# EAGLE schematic haasoscope_pro_adc_fpga_board (EAGLE 9.6.2), part 2 of 3
## Sheet 8 of 16: Other FPGA IO
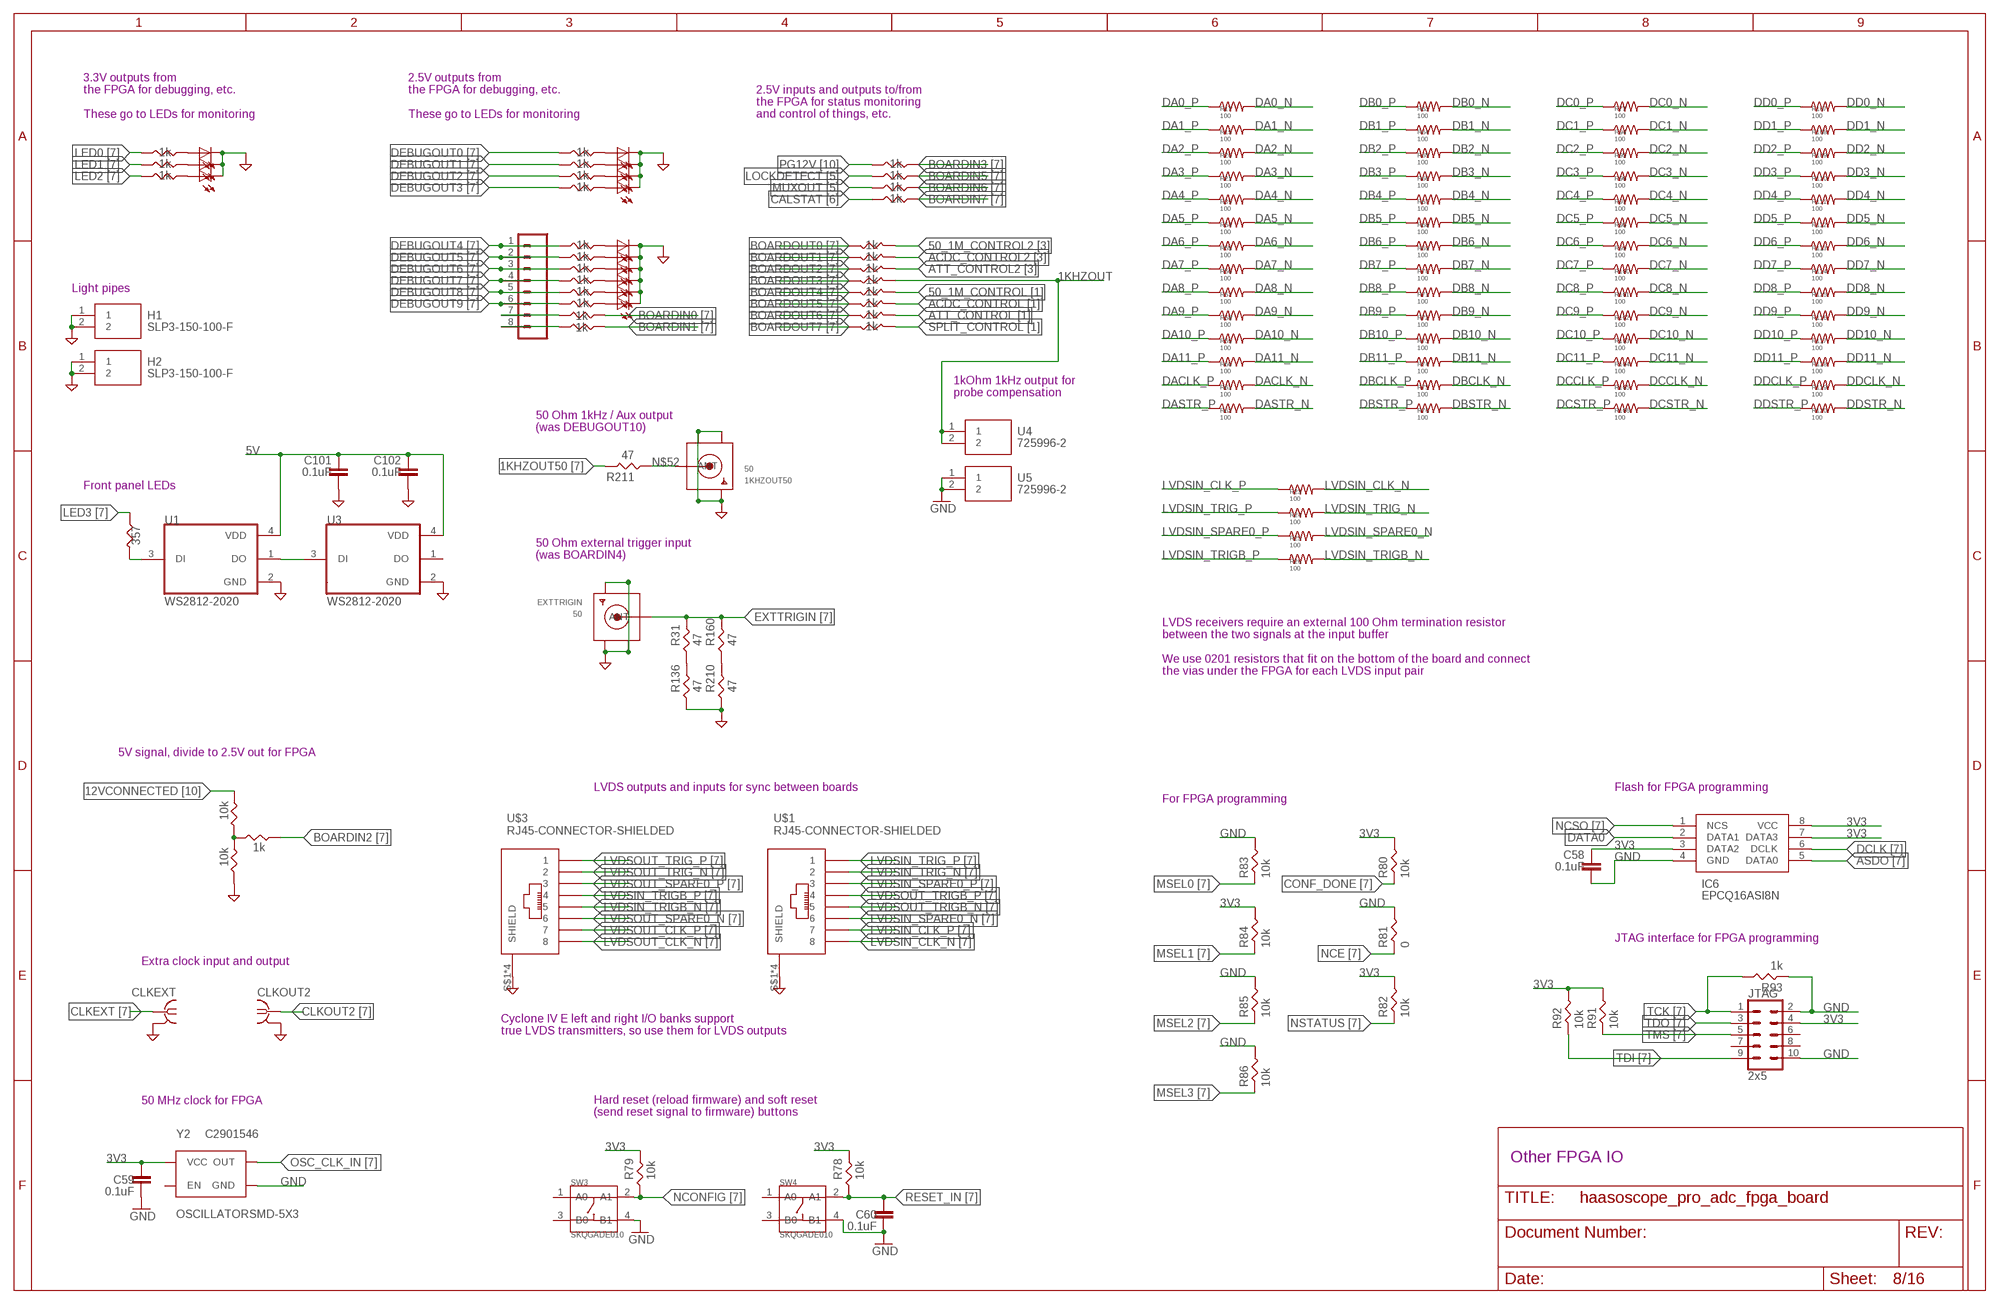
[diagram p7: schematic, sheet 8]

### Parts
1KHZOUT50  50  SMACONNECTOR_EDGE  [SMA_EDGELAUNCH]
C58  0.1uF  CAPACITOR_0402_N  [RESC0402_N]
C59  0.1uF  CAPACITOR_0402_N  [RESC0402_N]
C60  0.1uF  CAPACITOR_0402_N  [RESC0402_N]
C101  0.1uF  CAPACITOR_0402_N  [RESC0402_N]
C102  0.1uF  CAPACITOR_0402_N  [RESC0402_N]
CLKEXT  BU-SMB-V  [BU-SMB-V]
CLKOUT2  BU-SMB-V  [BU-SMB-V]
EXTTRIGIN  50  SMACONNECTOR_EDGE  [SMA_EDGELAUNCH]
H1  SLP3-150-100-F  [SLP3150100F]
H2  SLP3-150-100-F  [SLP3150100F]
IC6  EPCQ16ASI8N  [SOIC127P600X175-8N]
J11  8pin  CONN_08"  [1X08]
JTAG  2x5  CONN_05X2SHD  [2X5-SHROUDED]
LED25  red  LEDCHIP-LED0603  [CHIP-LED0603]
LED26  red  LEDCHIP-LED0603  [CHIP-LED0603]
LED27  red  LEDCHIP-LED0603  [CHIP-LED0603]
LED28  red  LEDCHIP-LED0603  [CHIP-LED0603]
LED29  red  LEDCHIP-LED0603  [CHIP-LED0603]
LED30  red  LEDCHIP-LED0603  [CHIP-LED0603]
LED41  red  LEDCHIP-LED0603  [CHIP-LED0603]
LED42  red  LEDCHIP-LED0603  [CHIP-LED0603]
LED43  red  LEDCHIP-LED0603  [CHIP-LED0603]
LED45  red  LEDCHIP-LED0603  [CHIP-LED0603]
LED46  red  LEDCHIP-LED0603  [CHIP-LED0603]
LED47  red  LEDCHIP-LED0603  [CHIP-LED0603]
LED48  red  LEDCHIP-LED0603  [CHIP-LED0603]
R6  1k  RES-0402  [RES-0402]
R7  1k  RES-0402  [RES-0402]
R8  1k  RES-0402  [RES-0402]
R9  1k  RES-0402  [RES-0402]
R10  1k  RES-0402  [RES-0402]
R11  1k  RES-0402  [RES-0402]
R12  1k  RES-0402  [RES-0402]
R13  1k  RES-0402  [RES-0402]
R16  1k  RES-0402  [RES-0402]
R17  100  R-US_R0201  [R0201]
R19  100  R-US_R0201  [R0201]
R20  100  R-US_R0201  [R0201]
R21  100  R-US_R0201  [R0201]
R22  1k  RES-0402  [RES-0402]
R23  100  R-US_R0201  [R0201]
R24  100  R-US_R0201  [R0201]
R25  100  R-US_R0201  [R0201]
R26  100  R-US_R0201  [R0201]
R31  47  RES-0402  [RES-0402]
R32  1k  RES-0402  [RES-0402]
R33  1k  RES-0402  [RES-0402]
R34  1k  RES-0402  [RES-0402]
R35  1k  RES-0402  [RES-0402]
R36  1k  RES-0402  [RES-0402]
R37  1k  RES-0402  [RES-0402]
R39  100  R-US_R0201  [R0201]
R46  1k  RES-0402  [RES-0402]
R47  1k  RES-0402  [RES-0402]
R48  1k  RES-0402  [RES-0402]
R49  1k  RES-0402  [RES-0402]
R50  357  RES-0402  [RES-0402]
R51  1k  RES-0402  [RES-0402]
R52  1k  RES-0402  [RES-0402]
R53  1k  RES-0402  [RES-0402]
R54  100  R-US_R0201  [R0201]
R55  100  R-US_R0201  [R0201]
R56  100  R-US_R0201  [R0201]
R57  100  R-US_R0201  [R0201]
R58  100  R-US_R0201  [R0201]
R59  100  R-US_R0201  [R0201]
R60  100  R-US_R0201  [R0201]
R61  100  R-US_R0201  [R0201]
R62  100  R-US_R0201  [R0201]
R63  100  R-US_R0201  [R0201]
R64  100  R-US_R0201  [R0201]
R65  100  R-US_R0201  [R0201]
R66  100  R-US_R0201  [R0201]
R67  100  R-US_R0201  [R0201]
R68  100  R-US_R0201  [R0201]
R69  100  R-US_R0201  [R0201]
R70  100  R-US_R0201  [R0201]
R71  100  R-US_R0201  [R0201]
R72  100  R-US_R0201  [R0201]
R73  100  R-US_R0201  [R0201]
R74  100  R-US_R0201  [R0201]
R75  100  R-US_R0201  [R0201]
R76  100  R-US_R0201  [R0201]
R77  100  R-US_R0201  [R0201]
R78  10k  RES-0402  [RES-0402]
R79  10k  RES-0402  [RES-0402]
R80  10k  RES-0402  [RES-0402]
R81  0  RES-0402  [RES-0402]
R82  10k  RES-0402  [RES-0402]
R83  10k  RES-0402  [RES-0402]
R84  10k  RES-0402  [RES-0402]
R85  10k  RES-0402  [RES-0402]
R86  10k  RES-0402  [RES-0402]
R91  10k  RES-0402  [RES-0402]
R92  10k  RES-0402  [RES-0402]
R93  1k  RES-0402  [RES-0402]
R94  100  R-US_R0201  [R0201]
R95  100  R-US_R0201  [R0201]
R96  100  R-US_R0201  [R0201]
R97  100  R-US_R0201  [R0201]
R98  100  R-US_R0201  [R0201]
R99  100  R-US_R0201  [R0201]
R100  100  R-US_R0201  [R0201]
R101  100  R-US_R0201  [R0201]
R102  100  R-US_R0201  [R0201]
R103  100  R-US_R0201  [R0201]
R104  100  R-US_R0201  [R0201]
R105  100  R-US_R0201  [R0201]
R106  100  R-US_R0201  [R0201]
R107  100  R-US_R0201  [R0201]
R108  100  R-US_R0201  [R0201]
R109  100  R-US_R0201  [R0201]
R110  100  R-US_R0201  [R0201]
R111  100  R-US_R0201  [R0201]
R112  100  R-US_R0201  [R0201]
R113  100  R-US_R0201  [R0201]
R114  100  R-US_R0201  [R0201]
R115  100  R-US_R0201  [R0201]
R116  100  R-US_R0201  [R0201]
R117  100  R-US_R0201  [R0201]
R118  100  R-US_R0201  [R0201]
R119  100  R-US_R0201  [R0201]
R120  100  R-US_R0201  [R0201]
R136  47  RES-0402  [RES-0402]
R160  47  RES-0402  [RES-0402]
R167  10k  RES-0402  [RES-0402]
R206  1k  RES-0402  [RES-0402]
R210  47  RES-0402  [RES-0402]
R211  47  RES-0402  [RES-0402]
R236  1k  RES-0402  [RES-0402]
R238  1k  RES-0402  [RES-0402]
R243  1k  RES-0402  [RES-0402]
R244  1k  RES-0402  [RES-0402]
R246  10k  RES-0402  [RES-0402]
SW3  SKQGADE010  SMD-BUTTON(4P-5.2X5.2X1.5MM-SKQGADE010)-SKQGADE010  [SW4-SMD-5.2X5.2X1.5MM]
SW4  SKQGADE010  SMD-BUTTON(4P-5.2X5.2X1.5MM-SKQGADE010)-SKQGADE010  [SW4-SMD-5.2X5.2X1.5MM]
U1  WS2812-2020  [LED_WS2812-2020]
U3  WS2812-2020  [LED_WS2812-2020]
U4  725996-2  [7259962]
U5  725996-2  [7259962]
U$1  RJ45-CONNECTOR-SHIELDED  [RJ45_THT_RA_AMPH-FRJAE448]
U$3  RJ45-CONNECTOR-SHIELDED  [RJ45_THT_RA_AMPH-FRJAE448]
Y2  OSCILLATORSMD-5X3  [OSCILLATOR-SMD-5X3.2]

### Nets
1KHZOUT: R206.P$1 U4.1 U4.2
1KHZOUT50: R211.P$2 ; also sheet 7
3V3 [power]: C58.2 C59.2 IC6.3(DATA2) IC6.7(DATA3) IC6.8(VCC) JTAG.4 R78.P$2 R79.P$2 R80.P$2 R82.P$2 R84.P$2 R91.P$2 R92.P$2 Y2.4(VCC) ; also sheet 2,4,5,9,11,13,14,15
5V [power]: C101.2 C102.2 U1.4(VDD) U3.4(VDD) ; also sheet 1,3,9,10,11,12,13,15
12VCONNECTED: R167.P$2 ; also sheet 10
50_1M_CONTROL: R8.P$1 ; also sheet 1
50_1M_CONTROL2: R12.P$1 ; also sheet 3
ACDC_CONTROL: R9.P$1 ; also sheet 1
ACDC_CONTROL2: R13.P$1 ; also sheet 3
ASDO: IC6.5(DATA0) ; also sheet 7
ATT_CONTROL: R10.P$1 ; also sheet 1
ATT_CONTROL2: R22.P$1 ; also sheet 3
BOARDIN0: R243.P$1 ; also sheet 7
BOARDIN1: R244.P$1 ; also sheet 7
BOARDIN2: R238.P$2 ; also sheet 7
BOARDIN3: R236.P$2 ; also sheet 7
BOARDIN5: R7.P$2 ; also sheet 7
BOARDIN6: R6.P$2 ; also sheet 7
BOARDIN7: R16.P$2 ; also sheet 7
BOARDOUT0: R12.P$2 ; also sheet 7
BOARDOUT1: R13.P$2 ; also sheet 7
BOARDOUT2: R22.P$2 ; also sheet 7
BOARDOUT3: R206.P$2 ; also sheet 7
BOARDOUT4: R8.P$2 ; also sheet 7
BOARDOUT5: R9.P$2 ; also sheet 7
BOARDOUT6: R10.P$2 ; also sheet 7
BOARDOUT7: R11.P$2 ; also sheet 7
CALSTAT: R16.P$1 ; also sheet 6
CLKEXT [critical]: CLKEXT.1 ; also sheet 7
CLKOUT2 [critical]: CLKOUT2.1 ; also sheet 7
CONF_DONE: R80.P$1 ; also sheet 7
DA0_N [diffpair]: R17.2 ; also sheet 6,7
DA0_P [diffpair]: R17.1 ; also sheet 6,7
DA1_N [diffpair]: R19.2 ; also sheet 6,7
DA1_P [diffpair]: R19.1 ; also sheet 6,7
DA2_N [diffpair]: R20.2 ; also sheet 6,7
DA2_P [diffpair]: R20.1 ; also sheet 6,7
DA3_N [diffpair]: R21.2 ; also sheet 6,7
DA3_P [diffpair]: R21.1 ; also sheet 6,7
DA4_N [diffpair]: R39.2 ; also sheet 6,7
DA4_P [diffpair]: R39.1 ; also sheet 6,7
DA5_N [diffpair]: R54.2 ; also sheet 6,7
DA5_P [diffpair]: R54.1 ; also sheet 6,7
DA6_N [diffpair]: R55.2 ; also sheet 6,7
DA6_P [diffpair]: R55.1 ; also sheet 6,7
DA7_N [diffpair]: R56.2 ; also sheet 6,7
DA7_P [diffpair]: R56.1 ; also sheet 6,7
DA8_N [diffpair]: R57.2 ; also sheet 6,7
DA8_P [diffpair]: R57.1 ; also sheet 6,7
DA9_N [diffpair]: R58.2 ; also sheet 6,7
DA9_P [diffpair]: R58.1 ; also sheet 6,7
DA10_N [diffpair]: R59.2 ; also sheet 6,7
DA10_P [diffpair]: R59.1 ; also sheet 6,7
DA11_N [diffpair]: R60.2 ; also sheet 6,7
DA11_P [diffpair]: R60.1 ; also sheet 6,7
DACLK_N [diffpair]: R61.2 ; also sheet 6,7
DACLK_P [diffpair]: R61.1 ; also sheet 6,7
DASTR_N [diffpair]: R62.2 ; also sheet 6,7
DASTR_P [diffpair]: R62.1 ; also sheet 6,7
DATA0: IC6.2(DATA1) ; also sheet 7
DB0_N [diffpair]: R63.2 ; also sheet 6,7
DB0_P [diffpair]: R63.1 ; also sheet 6,7
DB1_N [diffpair]: R64.2 ; also sheet 6,7
DB1_P [diffpair]: R64.1 ; also sheet 6,7
DB2_N [diffpair]: R65.2 ; also sheet 6,7
DB2_P [diffpair]: R65.1 ; also sheet 6,7
DB3_N [diffpair]: R66.2 ; also sheet 6,7
DB3_P [diffpair]: R66.1 ; also sheet 6,7
DB4_N [diffpair]: R67.2 ; also sheet 6,7
DB4_P [diffpair]: R67.1 ; also sheet 6,7
DB5_N [diffpair]: R68.2 ; also sheet 6,7
DB5_P [diffpair]: R68.1 ; also sheet 6,7
DB6_N [diffpair]: R69.2 ; also sheet 6,7
DB6_P [diffpair]: R69.1 ; also sheet 6,7
DB7_N [diffpair]: R70.2 ; also sheet 6,7
DB7_P [diffpair]: R70.1 ; also sheet 6,7
DB8_N [diffpair]: R71.2 ; also sheet 6,7
DB8_P [diffpair]: R71.1 ; also sheet 6,7
DB9_N [diffpair]: R72.2 ; also sheet 6,7
DB9_P [diffpair]: R72.1 ; also sheet 6,7
DB10_N [diffpair]: R73.2 ; also sheet 6,7
DB10_P [diffpair]: R73.1 ; also sheet 6,7
DB11_N [diffpair]: R74.2 ; also sheet 6,7
DB11_P [diffpair]: R74.1 ; also sheet 6,7
DBCLK_N [diffpair]: R75.2 ; also sheet 6,7
DBCLK_P [diffpair]: R75.1 ; also sheet 6,7
DBSTR_N [diffpair]: R76.2 ; also sheet 6,7
DBSTR_P [diffpair]: R76.1 ; also sheet 6,7
DC0_N [diffpair]: R77.2 ; also sheet 6,7
DC0_P [diffpair]: R77.1 ; also sheet 6,7
DC1_N [diffpair]: R94.2 ; also sheet 6,7
DC1_P [diffpair]: R94.1 ; also sheet 6,7
DC2_N [diffpair]: R95.2 ; also sheet 6,7
DC2_P [diffpair]: R95.1 ; also sheet 6,7
DC3_N [diffpair]: R96.2 ; also sheet 6,7
DC3_P [diffpair]: R96.1 ; also sheet 6,7
DC4_N [diffpair]: R97.2 ; also sheet 6,7
DC4_P [diffpair]: R97.1 ; also sheet 6,7
DC5_N [diffpair]: R98.2 ; also sheet 6,7
DC5_P [diffpair]: R98.1 ; also sheet 6,7
DC6_N [diffpair]: R99.2 ; also sheet 6,7
DC6_P [diffpair]: R99.1 ; also sheet 6,7
DC7_N [diffpair]: R100.2 ; also sheet 6,7
DC7_P [diffpair]: R100.1 ; also sheet 6,7
DC8_N [diffpair]: R101.2 ; also sheet 6,7
DC8_P [diffpair]: R101.1 ; also sheet 6,7
DC9_N [diffpair]: R102.2 ; also sheet 6,7
DC9_P [diffpair]: R102.1 ; also sheet 6,7
DC10_N [diffpair]: R103.2 ; also sheet 6,7
DC10_P [diffpair]: R103.1 ; also sheet 6,7
DC11_N [diffpair]: R104.2 ; also sheet 6,7
DC11_P [diffpair]: R104.1 ; also sheet 6,7
DCCLK_N [diffpair]: R105.2 ; also sheet 6,7
DCCLK_P [diffpair]: R105.1 ; also sheet 6,7
DCLK: IC6.6(DCLK) ; also sheet 7
DCSTR_N [diffpair]: R106.2 ; also sheet 6,7
DCSTR_P [diffpair]: R106.1 ; also sheet 6,7
DD0_N [diffpair]: R107.2 ; also sheet 6,7
DD0_P [diffpair]: R107.1 ; also sheet 6,7
DD1_N [diffpair]: R108.2 ; also sheet 6,7
DD1_P [diffpair]: R108.1 ; also sheet 6,7
DD2_N [diffpair]: R109.2 ; also sheet 6,7
DD2_P [diffpair]: R109.1 ; also sheet 6,7
DD3_N [diffpair]: R110.2 ; also sheet 6,7
DD3_P [diffpair]: R110.1 ; also sheet 6,7
DD4_N [diffpair]: R111.2 ; also sheet 6,7
DD4_P [diffpair]: R111.1 ; also sheet 6,7
DD5_N [diffpair]: R112.2 ; also sheet 6,7
DD5_P [diffpair]: R112.1 ; also sheet 6,7
DD6_N [diffpair]: R113.2 ; also sheet 6,7
DD6_P [diffpair]: R113.1 ; also sheet 6,7
DD7_N [diffpair]: R114.2 ; also sheet 6,7
DD7_P [diffpair]: R114.1 ; also sheet 6,7
DD8_N [diffpair]: R115.2 ; also sheet 6,7
DD8_P [diffpair]: R115.1 ; also sheet 6,7
DD9_N [diffpair]: R116.2 ; also sheet 6,7
DD9_P [diffpair]: R116.1 ; also sheet 6,7
DD10_N [diffpair]: R117.2 ; also sheet 6,7
DD10_P [diffpair]: R117.1 ; also sheet 6,7
DD11_N [diffpair]: R118.2 ; also sheet 6,7
DD11_P [diffpair]: R118.1 ; also sheet 6,7
DDCLK_N [diffpair]: R119.2 ; also sheet 6,7
DDCLK_P [diffpair]: R119.1 ; also sheet 6,7
DDSTR_N [diffpair]: R120.2 ; also sheet 6,7
DDSTR_P [diffpair]: R120.1 ; also sheet 6,7
DEBUGOUT0: R49.P$1 ; also sheet 7
DEBUGOUT1: R48.P$1 ; also sheet 7
DEBUGOUT2: R47.P$1 ; also sheet 7
DEBUGOUT3: R46.P$1 ; also sheet 7
DEBUGOUT4: J11.1 R37.P$1 ; also sheet 7
DEBUGOUT5: J11.2 R36.P$1 ; also sheet 7
DEBUGOUT6: J11.3 R35.P$1 ; also sheet 7
DEBUGOUT7: J11.4 R34.P$1 ; also sheet 7
DEBUGOUT8: J11.5 R33.P$1 ; also sheet 7
DEBUGOUT9: J11.6 R32.P$1 ; also sheet 7
EXTTRIGIN [critical]: EXTTRIGIN.P(ANT) R31.P$2 R160.P$2 ; also sheet 7
GND: 1KHZOUT50.GND@1(GND4) 1KHZOUT50.GND@2(GND3) 1KHZOUT50.GND@3(GND2) 1KHZOUT50.GND@4(GND1) C58.1 C59.1 C60.1 C101.1 C102.1 CLKEXT.2 CLKEXT.3 CLKEXT.4 CLKEXT.5 CLKOUT2.2 CLKOUT2.3 CLKOUT2.4 CLKOUT2.5 EXTTRIGIN.GND@1(GND4) EXTTRIGIN.GND@2(GND3) EXTTRIGIN.GND@3(GND2) EXTTRIGIN.GND@4(GND1) H1.1 H1.2 H2.1 H2.2 IC6.4(GND) JTAG.2 JTAG.10 LED25.C LED26.C LED27.C LED28.C LED29.C LED30.C LED41.C LED42.C LED43.C LED45.C LED46.C LED47.C LED48.C R81.P$2 R83.P$2 R85.P$2 R86.P$2 R93.P$1 R136.P$1 R210.P$1 R246.P$1 SW3.4(B1) SW4.4(B1) U1.2(GND) U3.2(GND) U5.1 U5.2 U$1.S$1(SHIELD) U$1.S$2(SHIELD) U$1.S$3(SHIELD) U$1.S$4(SHIELD) U$3.S$1(SHIELD) U$3.S$2(SHIELD) U$3.S$3(SHIELD) U$3.S$4(SHIELD) Y2.2(GND) ; also sheet 1,2,3,4,5,6,7,9,10,11,12,13,14,15
LED0: R53.P$1 ; also sheet 7
LED1: R52.P$1 ; also sheet 7
LED2: R51.P$1 ; also sheet 7
LED3: R50.P$1 ; also sheet 7
LOCKDETECT: R7.P$1 ; also sheet 5
LVDSIN_CLK_N [diffpair]: R23.2 U$1.P$8 ; also sheet 7
LVDSIN_CLK_P [diffpair]: R23.1 U$1.P$7 ; also sheet 7
LVDSIN_SPARE0_N [diffpair]: R25.2 U$1.P$6 ; also sheet 7
LVDSIN_SPARE0_P [diffpair]: R25.1 U$1.P$3 ; also sheet 7
LVDSIN_TRIG_N [diffpair]: R24.2 U$1.P$2 ; also sheet 7
LVDSIN_TRIG_P [diffpair]: R24.1 U$1.P$1 ; also sheet 7
LVDSIN_TRIGB_N [diffpair]: R26.2 U$3.P$5 ; also sheet 7
LVDSIN_TRIGB_P [diffpair]: R26.1 U$3.P$4 ; also sheet 7
LVDSOUT_CLK_N [diffpair]: U$3.P$8 ; also sheet 7
LVDSOUT_CLK_P [diffpair]: U$3.P$7 ; also sheet 7
LVDSOUT_SPARE0_N [diffpair]: U$3.P$6 ; also sheet 7
LVDSOUT_SPARE0_P [diffpair]: U$3.P$3 ; also sheet 7
LVDSOUT_TRIG_N [diffpair]: U$3.P$2 ; also sheet 7
LVDSOUT_TRIG_P [diffpair]: U$3.P$1 ; also sheet 7
LVDSOUT_TRIGB_N [diffpair]: U$1.P$5 ; also sheet 7
LVDSOUT_TRIGB_P [diffpair]: U$1.P$4 ; also sheet 7
MSEL0: R83.P$1 ; also sheet 7
MSEL1: R84.P$1 ; also sheet 7
MSEL2: R85.P$1 ; also sheet 7
MSEL3: R86.P$1 ; also sheet 7
MUXOUT: R6.P$1 ; also sheet 5
N$13: R31.P$1 R136.P$2
N$25: LED25.A R37.P$2
N$26: LED26.A R36.P$2
N$27: LED27.A R35.P$2
N$28: LED28.A R34.P$2
N$29: LED29.A R33.P$2
N$30: LED30.A R32.P$2
N$31: R160.P$1 R210.P$2
N$41: LED41.A R53.P$2
N$42: LED42.A R52.P$2
N$43: LED43.A R51.P$2
N$44: R50.P$2 U1.3(DI)
N$45: LED45.A R49.P$2
N$46: LED46.A R48.P$2
N$47: LED47.A R47.P$2
N$48: LED48.A R46.P$2
N$52: 1KHZOUT50.P(ANT) R211.P$1
N$68: J11.7 R243.P$2
N$69: J11.8 R244.P$2
N$84: R167.P$1 R238.P$1 R246.P$2
N$85: U1.1(DO) U3.3(DI)
NCE: R81.P$1 ; also sheet 7
NCONFIG: R79.P$1 SW3.2(A1) ; also sheet 7
NCSO: IC6.1(NCS) ; also sheet 7
NSTATUS: R82.P$1 ; also sheet 7
OSC_CLK_IN: Y2.3(OUT) ; also sheet 7
PG12V: R236.P$1 ; also sheet 10
RESET_IN: C60.2 R78.P$1 SW4.2(A1) ; also sheet 7
SPLIT_CONTROL: R11.P$1 ; also sheet 1
TCK: JTAG.1 R93.P$2 ; also sheet 7
TDI: JTAG.9 R92.P$1 ; also sheet 7
TDO: JTAG.3 ; also sheet 7
TMS: JTAG.5 R91.P$1 ; also sheet 7
Unconnected: JTAG.6 JTAG.7 JTAG.8 SW3.1(A0) SW3.3(B0) SW4.1(A0) SW4.3(B0) U3.1(DO) Y2.1(EN)

### Notes on the sheet
- 3.3V outputs from
  the FPGA for debugging, etc.
  
  These go to LEDs for monitoring
- 2.5V outputs from
  the FPGA for debugging, etc.
  
  These go to LEDs for monitoring
- 2.5V inputs and outputs to/from
  the FPGA for status monitoring
  and control of things, etc.
- Light pipes
- 1kOhm 1kHz output for 
  probe compensation
- 50 Ohm 1kHz / Aux output
  (was DEBUGOUT10)
- Front panel LEDs
- 50 Ohm external trigger input
  (was BOARDIN4)
- LVDS receivers require an external 100 Ohm termination resistor
  between the two signals at the input buffer
  
  We use 0201 resistors that fit on the bottom of the board and connect
  the vias under the FPGA for each LVDS input pair
- 5V signal, divide to 2.5V out for FPGA
- LVDS outputs and inputs for sync between boards | Flash for FPGA programming
- For FPGA programming
- JTAG interface for FPGA programming
- Extra clock input and output
- Cyclone IV E left and right I/O banks support 
  true LVDS transmitters, so use them for LVDS outputs
- 50 MHz clock for FPGA
- Hard reset (reload firmware) and soft reset
  (send reset signal to firmware) buttons
- Other FPGA IO

## Sheet 9 of 16: Data output
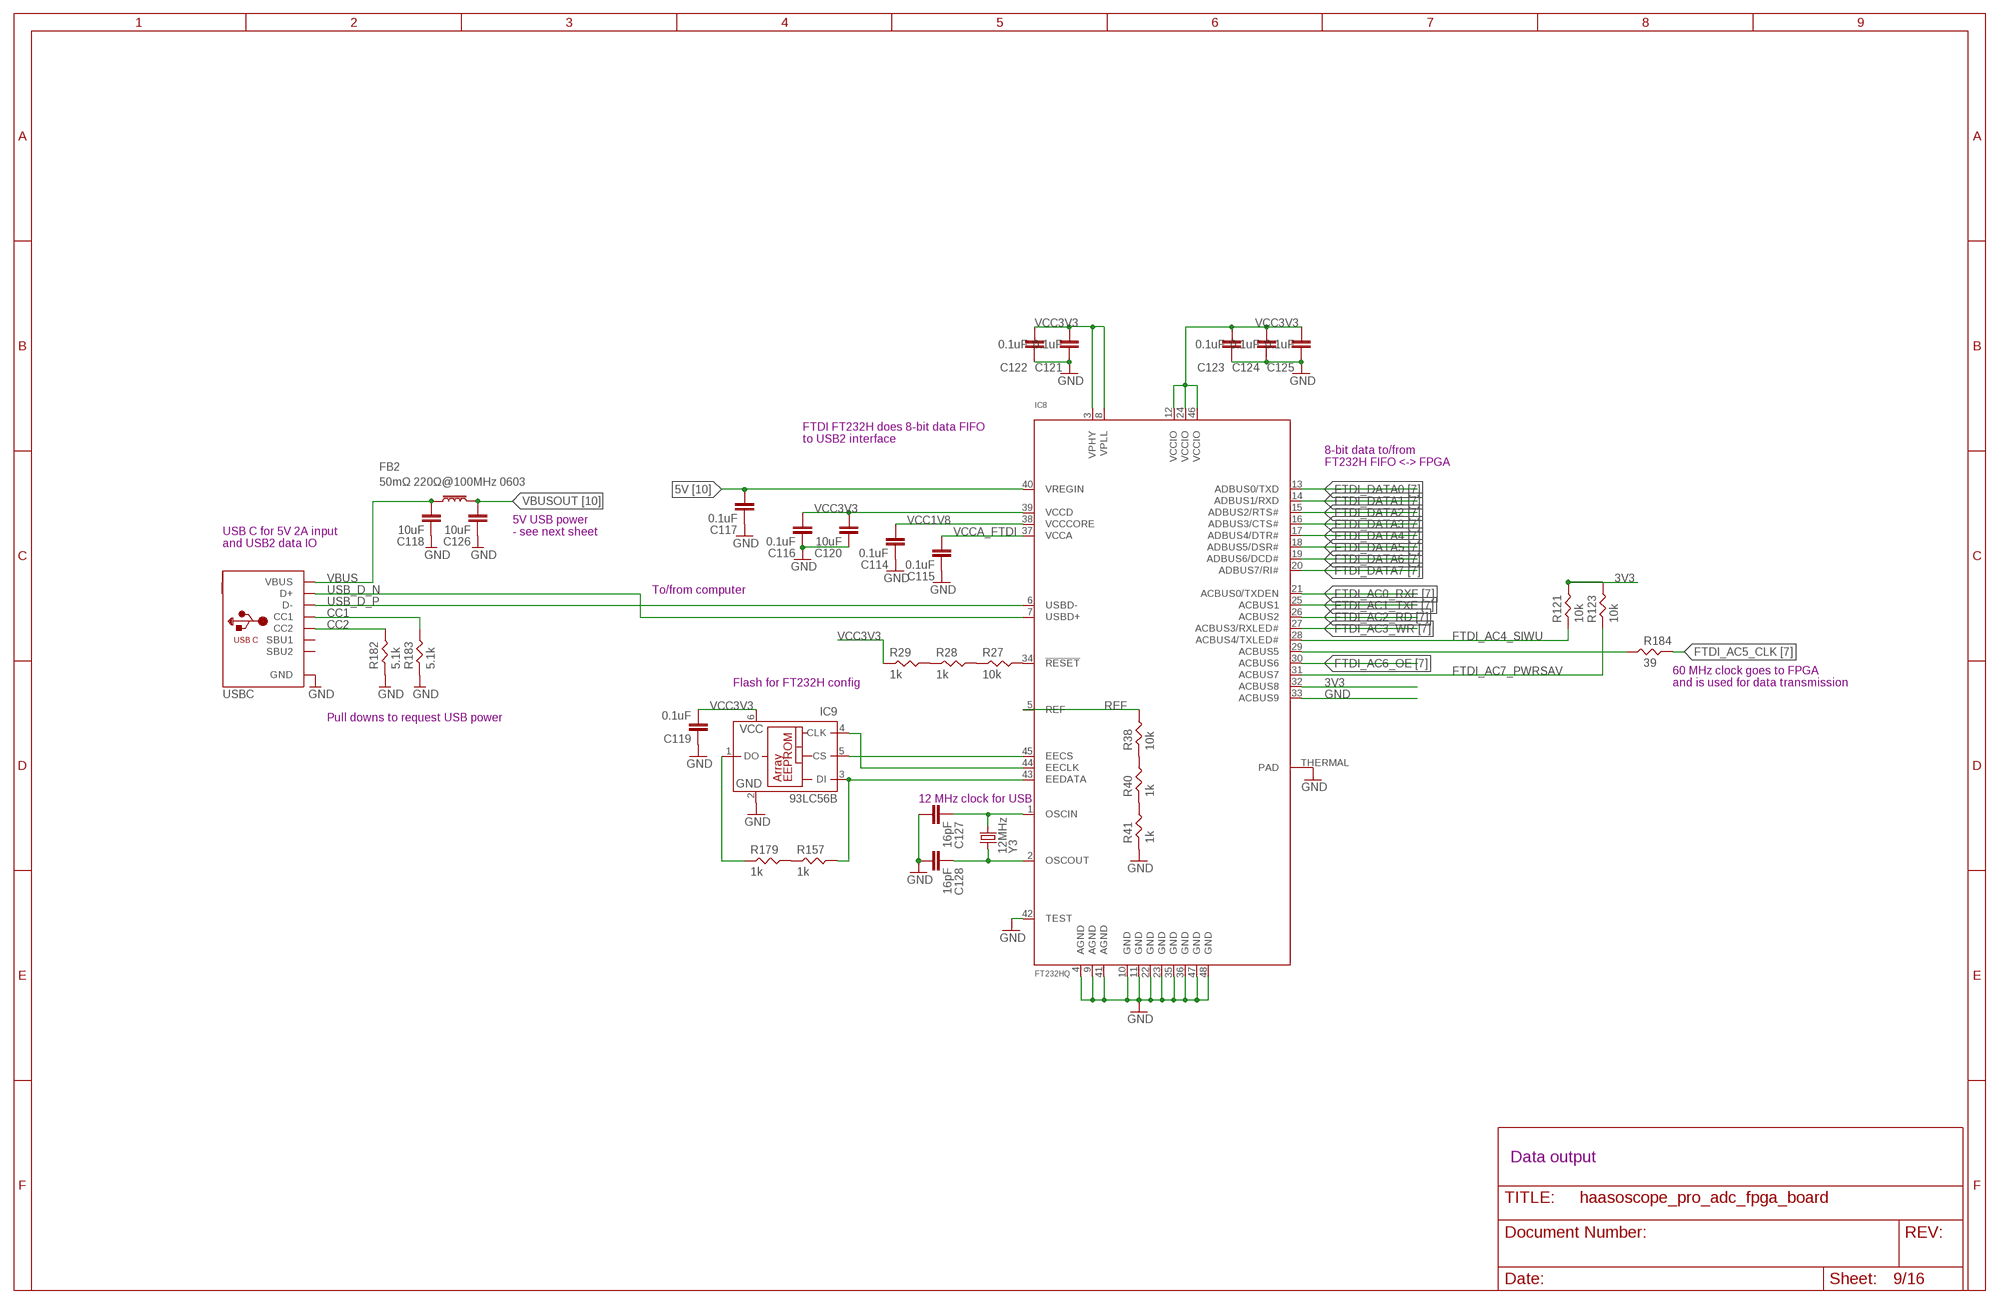
[diagram p8: schematic, sheet 9]

### Parts
C114  0.1uF  CAPACITOR_0402_N  [RESC0402_N]
C115  0.1uF  CAPACITOR_0402_N  [RESC0402_N]
C116  0.1uF  CAPACITOR_0402_N  [RESC0402_N]
C117  0.1uF  CAPACITOR_0402_N  [RESC0402_N]
C118  10uF  CAPACITOR_0805_N  [RESC0805_N]
C119  0.1uF  CAPACITOR_0402_N  [RESC0402_N]
C120  10uF  CAPACITOR_0805_N  [RESC0805_N]
C121  0.1uF  CAPACITOR_0402_N  [RESC0402_N]
C122  0.1uF  CAPACITOR_0402_N  [RESC0402_N]
C123  0.1uF  CAPACITOR_0402_N  [RESC0402_N]
C124  0.1uF  CAPACITOR_0402_N  [RESC0402_N]
C125  0.1uF  CAPACITOR_0402_N  [RESC0402_N]
C126  10uF  CAPACITOR_0805_N  [RESC0805_N]
C127  16pF  CAPACITOR_0402_N  [RESC0402_N]
C128  16pF  CAPACITOR_0402_N  [RESC0402_N]
FB2  50mΩ 220Ω@100MHz 0603  FERRITE_BEAD-0603  [0603]
IC8  FT232HQ  [QFN48_8MM]
IC9  93LC56B  93LC76A  [SOT23-6]
R27  10k  RES-0402  [RES-0402]
R28  1k  RES-0402  [RES-0402]
R29  1k  RES-0402  [RES-0402]
R38  10k  RES-0402  [RES-0402]
R40  1k  RES-0402  [RES-0402]
R41  1k  RES-0402  [RES-0402]
R121  10k  RES-0402  [RES-0402]
R123  10k  RES-0402  [RES-0402]
R157  1k  RES-0402  [RES-0402]
R179  1k  RES-0402  [RES-0402]
R182  5.1k  RES-0402  [RES-0402]
R183  5.1k  RES-0402  [RES-0402]
R184  39  RES-0402  [RES-0402]
X1  USBC  USB_C  [USB_C_CUSB31-CFM2AX-01-X]
Y3  12MHz  CRYSTALCRYSTAL-SMD-5X3-12MHZ  [CRYSTAL-SMD-5X3]

### Nets
3V3 [power]: IC8.32(ACBUS8) R121.P$2 R123.P$2 ; also sheet 2,4,5,8,11,13,14,15
5V [power]: C117.2 IC8.40(VREGIN) ; also sheet 1,3,8,10,11,12,13,15
CC1: R183.P$2 X1.A5(CC1)
CC2: R182.P$2 X1.B5(CC2)
FTDI_AC0_RXF [critical]: IC8.21(ACBUS0/TXDEN) ; also sheet 7
FTDI_AC1_TXE [critical]: IC8.25(ACBUS1) ; also sheet 7
FTDI_AC2_RD [critical]: IC8.26(ACBUS2) ; also sheet 7
FTDI_AC3_WR [critical]: IC8.27(ACBUS3/RXLED#) ; also sheet 7
FTDI_AC4_SIWU [critical]: IC8.28(ACBUS4/TXLED#) R121.P$1
FTDI_AC5_CLK [critical]: R184.P$2 ; also sheet 7
FTDI_AC6_OE [critical]: IC8.30(ACBUS6) ; also sheet 7
FTDI_AC7_PWRSAV [critical]: IC8.31(ACBUS7) R123.P$1
FTDI_DATA0 [critical]: IC8.13(ADBUS0/TXD) ; also sheet 7
FTDI_DATA1 [critical]: IC8.14(ADBUS1/RXD) ; also sheet 7
FTDI_DATA2 [critical]: IC8.15(ADBUS2/RTS#) ; also sheet 7
FTDI_DATA3 [critical]: IC8.16(ADBUS3/CTS#) ; also sheet 7
FTDI_DATA4 [critical]: IC8.17(ADBUS4/DTR#) ; also sheet 7
FTDI_DATA5 [critical]: IC8.18(ADBUS5/DSR#) ; also sheet 7
FTDI_DATA6 [critical]: IC8.19(ADBUS6/DCD#) ; also sheet 7
FTDI_DATA7 [critical]: IC8.20(ADBUS7/RI#) ; also sheet 7
GND: C114.1 C115.1 C116.1 C117.1 C118.1 C119.1 C120.1 C121.1 C122.1 C123.1 C124.1 C125.1 C126.1 C127.2 C128.2 IC8.4(AGND) IC8.9(AGND) IC8.10(GND) IC8.11(GND) IC8.22(GND) IC8.23(GND) IC8.33(ACBUS9) IC8.35(GND) IC8.36(GND) IC8.41(AGND) IC8.42(TEST) IC8.47(GND) IC8.48(GND) IC8.THERMAL(PAD) IC9.2(GND) R41.P$1 R182.P$1 R183.P$1 X1.A1B12(GND) X1.B1A12(GND) ; also sheet 1,2,3,4,5,6,7,8,10,11,12,13,14,15
N$3: R27.P$1 R28.P$2
N$4: R28.P$1 R29.P$2
N$19: R38.P$1 R40.P$2
N$34: R40.P$1 R41.P$2
N$37: R157.P$1 R179.P$2
N$62: C127.1 IC8.1(OSCIN) Y3.3
N$63: C128.1 IC8.2(OSCOUT) Y3.1
N$74: IC8.34(!RESET) R27.P$2
N$75: IC8.43(EEDATA) IC9.3(DI) R157.P$2
N$76: IC8.45(EECS) IC9.5(CS)
N$77: IC8.44(EECLK) IC9.4(CLK)
N$78: IC9.1(DO) R179.P$1
N$80: IC8.29(ACBUS5) R184.P$1
REF: IC8.5(REF) R38.P$2
USB_D_N [loosediffpair]: IC8.7(USBD+) X1.A6(D+) X1.B6(D+)
USB_D_P [loosediffpair]: IC8.6(USBD-) X1.A7(D-) X1.B7(D-)
VBUS [power]: C118.2 FB2.1 X1.A4B9(VBUS) X1.B4A9(VBUS)
VBUSOUT [power]: C126.2 FB2.2 ; also sheet 10
VCC1V8: C114.2 IC8.38(VCCCORE)
VCC3V3: C116.2 C119.2 C120.2 C121.2 C122.2 C123.2 C124.2 C125.2 IC8.3(VPHY) IC8.8(VPLL) IC8.12(VCCIO) IC8.24(VCCIO) IC8.39(VCCD) IC8.46(VCCIO) IC9.6(VCC) R29.P$1
VCCA_FTDI [power]: C115.2 IC8.37(VCCA)
Unconnected: X1.A8(SBU1) X1.B8(SBU2)

### Notes on the sheet
- FTDI FT232H does 8-bit data FIFO
  to USB2 interface
- 8-bit data to/from 
  FT232H FIFO <-> FPGA
- 5V USB power
  - see next sheet
- USB C for 5V 2A input
  and USB2 data IO
- To/from computer
- Flash for FT232H config
- 60 MHz clock goes to FPGA
  and is used for data transmission
- Pull downs to request USB power
- 12 MHz clock for USB
- Data output

## Sheet 10 of 16: Power - 12V
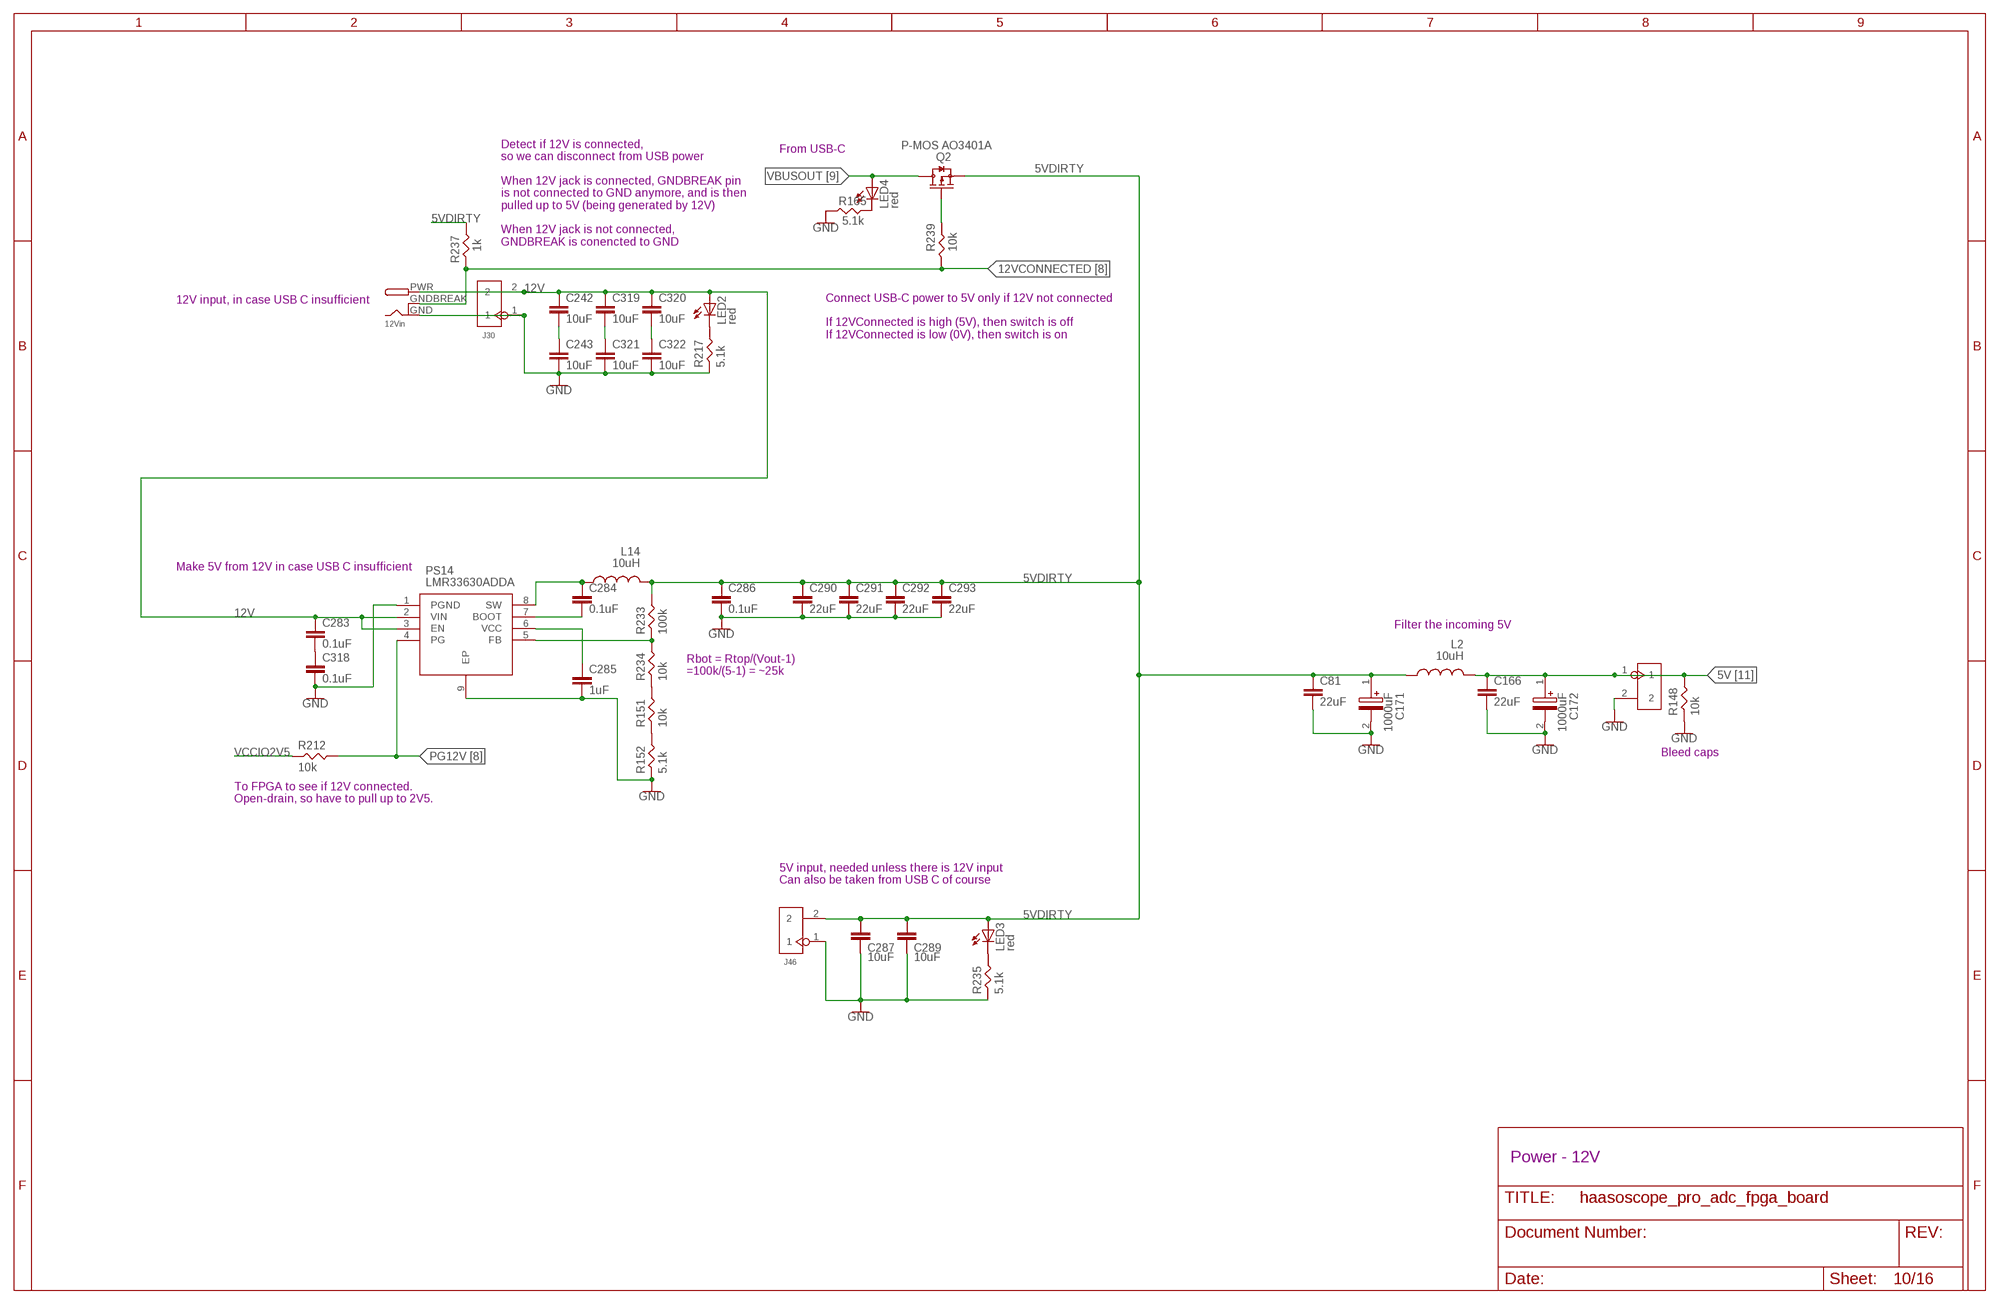
[diagram p9: schematic, sheet 10]

### Parts
C81  22uF  CAPACITOR_0805_N  [RESC0805_N]
C166  22uF  CAPACITOR_0805_N  [RESC0805_N]
C171  1000uF  EEE-FT1E102UP  [EEE0JA152UAP]
C172  1000uF  EEE-FT1E102UP  [EEE0JA152UAP]
C242  10uF  CAPACITOR_0805_N  [RESC0805_N]
C243  10uF  CAPACITOR_0805_N  [RESC0805_N]
C283  0.1uF  CAPACITOR_0402_N  [RESC0402_N]
C284  0.1uF  CAPACITOR_0402_N  [RESC0402_N]
C285  1uF  CAPACITOR_0402_N  [RESC0402_N]
C286  0.1uF  CAPACITOR_0402_N  [RESC0402_N]
C287  10uF  CAPACITOR_0805_N  [RESC0805_N]
C289  10uF  CAPACITOR_0805_N  [RESC0805_N]
C290  22uF  CAPACITOR_0805_N  [RESC0805_N]
C291  22uF  CAPACITOR_0805_N  [RESC0805_N]
C292  22uF  CAPACITOR_0805_N  [RESC0805_N]
C293  22uF  CAPACITOR_0805_N  [RESC0805_N]
C318  0.1uF  CAPACITOR_0402_N  [RESC0402_N]
C319  10uF  CAPACITOR_0805_N  [RESC0805_N]
C320  10uF  CAPACITOR_0805_N  [RESC0805_N]
C321  10uF  CAPACITOR_0805_N  [RESC0805_N]
C322  10uF  CAPACITOR_0805_N  [RESC0805_N]
CN2  12Vin  DCBARRELPTH  [DCJACK_2MM_PTH]
J30  2p-2.54  DIP-BLACK-MALE-HEADER-VERT(2P-2.54)  [H2-2.54]
J45  2p-2.54  DIP-BLACK-MALE-HEADER-VERT(2P-2.54)  [H2-2.54]
J46  2p-2.54  DIP-BLACK-MALE-HEADER-VERT(2P-2.54)  [H2-2.54]
L2  10uH  INDUCTORPWR  [CDRH125]
L14  10uH  INDUCTORPWR  [CDRH125]
LED2  red  LEDCHIP-LED0603  [CHIP-LED0603]
LED3  red  LEDCHIP-LED0603  [CHIP-LED0603]
LED4  red  LEDCHIP-LED0603  [CHIP-LED0603]
PS14  LMR33630ADDA  [SOIC127P600X170-9N]
Q2  FDN340P  SMD-MOSFET-P-CH-20V-2A-FDN340P(SOT-23)  [SOT-23]
R148  10k  RES-0402  [RES-0402]
R151  10k  RES-0402  [RES-0402]
R152  5.1k  RES-0402  [RES-0402]
R165  5.1k  RES-0402  [RES-0402]
R212  10k  RES-0402  [RES-0402]
R217  5.1k  RES-0402  [RES-0402]
R233  100k  RES-0402  [RES-0402]
R234  10k  RES-0402  [RES-0402]
R235  5.1k  RES-0402  [RES-0402]
R237  1k  RES-0402  [RES-0402]
R239  10k  RES-0402  [RES-0402]

### Nets
5V [power]: C166.1 C172.1(+) J45.1 L2.2 R148.P$2 ; also sheet 1,3,8,9,11,12,13,15
5VDIRTY [power]: C81.1 C171.1(+) C286.1 C287.1 C289.1 C290.1 C291.1 C292.1 C293.1 J46.2 L2.1 L14.2 LED3.A Q2.2(S) R233.P$2 R237.P$2
12V: C242.1 C283.1 C319.1 C320.1 CN2.PWR J30.2 LED2.A PS14.2(VIN) PS14.3(EN)
12VCONNECTED: CN2.GNDBREAK R237.P$1 R239.P$1 ; also sheet 8
GND: C81.2 C166.2 C171.2(-) C172.2(-) C243.2 C285.2 C286.2 C287.2 C289.2 C290.2 C291.2 C292.2 C293.2 C318.2 C321.2 C322.2 CN2.GND J30.1 J45.2 J46.1 PS14.1(PGND) PS14.9(EP) R148.P$1 R152.P$1 R165.P$1 R217.P$1 R235.P$1 ; also sheet 1,2,3,4,5,6,7,8,9,11,12,13,14,15
N$35: R151.P$2 R234.P$1
N$36: R151.P$1 R152.P$2
N$59: LED2.C R217.P$2
N$60: LED3.C R235.P$2
N$65: Q2.1(G) R239.P$2
N$79: LED4.C R165.P$2
N$101: C242.2 C243.1
N$129: C284.1 L14.1 PS14.8(SW)
N$130: C284.2 PS14.7(BOOT)
N$131: PS14.5(FB) R233.P$1 R234.P$2
N$132: C285.1 PS14.6(VCC)
N$135: C283.2 C318.1
N$136: C319.2 C321.1
N$137: C320.2 C322.1
PG12V: PS14.4(PG) R212.P$2 ; also sheet 8
VBUSOUT [power]: LED4.A Q2.3(D) ; also sheet 9
VCCIO2V5 [power]: R212.P$1 ; also sheet 7,14

### Notes on the sheet
- From USB-C
- Detect if 12V is connected,
  so we can disconnect from USB power
  
  When 12V jack is connected, GNDBREAK pin
  is not connected to GND anymore, and is then
  pulled up to 5V (being generated by 12V)
  
  When 12V jack is not connected,
  GNDBREAK is conencted to GND
- 12V input, in case USB C insufficient
- Connect USB-C power to 5V only if 12V not connected
  
  If 12VConnected is high (5V), then switch is off
  If 12VConnected is low (0V), then switch is on
- Make 5V from 12V in case USB C insufficient
- Filter the incoming 5V
- Rbot = Rtop/(Vout-1)
  =100k/(5-1) = ~25k
- Bleed caps
- To FPGA to see if 12V connected.
  Open-drain, so have to pull up to 2V5.
- 5V input, needed unless there is 12V input
  Can also be taken from USB C of course
- Power - 12V

## Sheet 11 of 16: Power - Amps
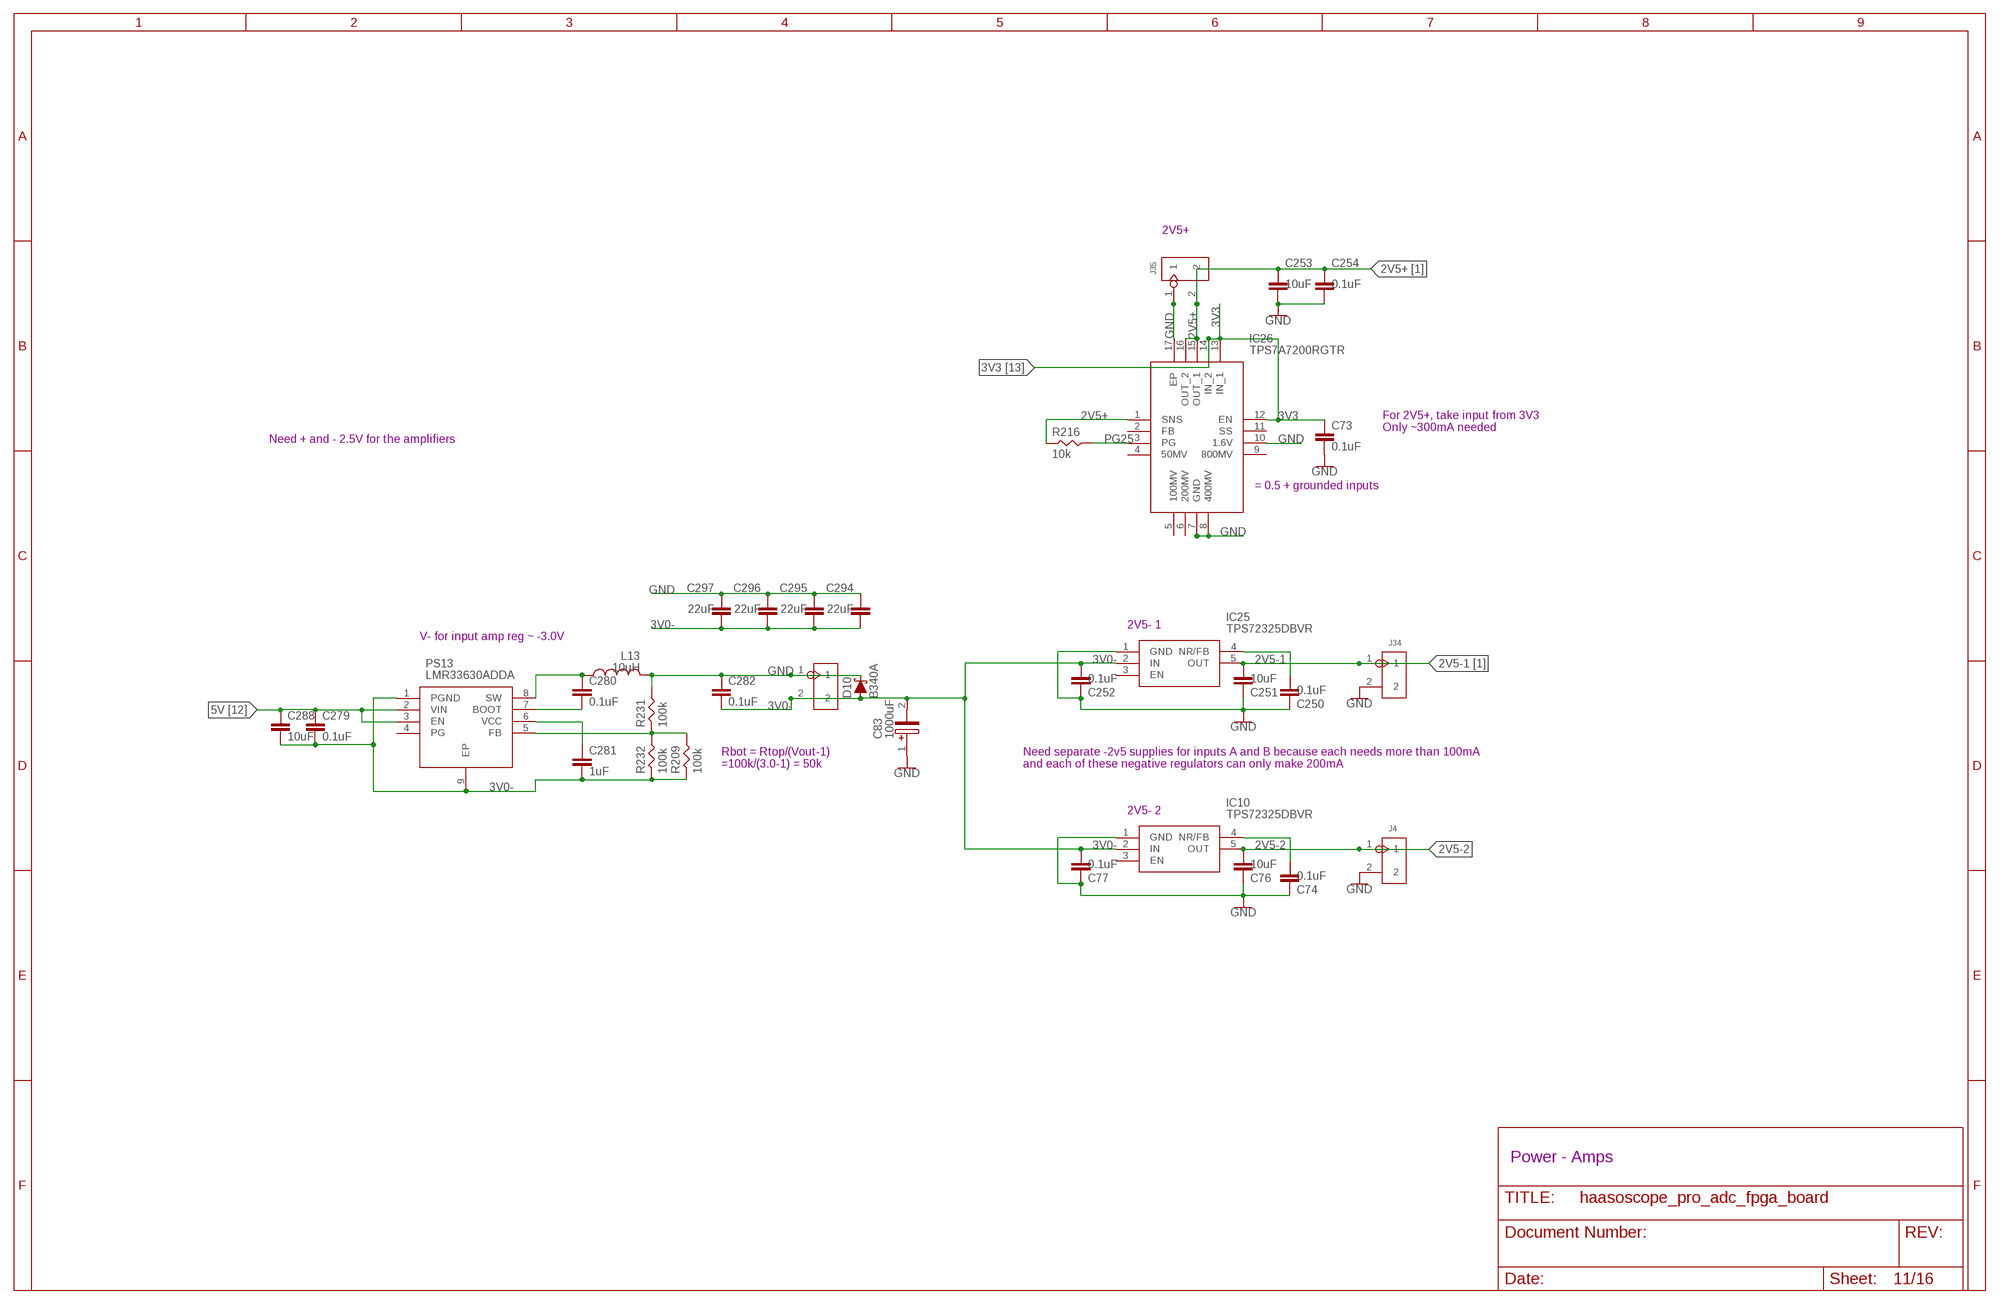
[diagram p10: schematic, sheet 11]

### Parts
C73  0.1uF  CAPACITOR_0402_N  [RESC0402_N]
C74  0.1uF  CAPACITOR_0402_N  [RESC0402_N]
C76  10uF  CAPACITOR_0805_N  [RESC0805_N]
C77  0.1uF  CAPACITOR_0402_N  [RESC0402_N]
C83  1000uF  EEE-FT1E102UP  [EEE0JA152UAP]
C250  0.1uF  CAPACITOR_0402_N  [RESC0402_N]
C251  10uF  CAPACITOR_0805_N  [RESC0805_N]
C252  0.1uF  CAPACITOR_0402_N  [RESC0402_N]
C253  10uF  CAPACITOR_0805_N  [RESC0805_N]
C254  0.1uF  CAPACITOR_0402_N  [RESC0402_N]
C279  0.1uF  CAPACITOR_0402_N  [RESC0402_N]
C280  0.1uF  CAPACITOR_0402_N  [RESC0402_N]
C281  1uF  CAPACITOR_0402_N  [RESC0402_N]
C282  0.1uF  CAPACITOR_0402_N  [RESC0402_N]
C288  10uF  CAPACITOR_0805_N  [RESC0805_N]
C294  22uF  CAPACITOR_0805_N  [RESC0805_N]
C295  22uF  CAPACITOR_0805_N  [RESC0805_N]
C296  22uF  CAPACITOR_0805_N  [RESC0805_N]
C297  22uF  CAPACITOR_0805_N  [RESC0805_N]
D10  B340A  DIODE-SCHOTTKY-B340A  [SMA-DIODE]
IC10  TPS72325DBVR  [SOT95P280X145-5N]
IC25  TPS72325DBVR  [SOT95P280X145-5N]
IC26  TPS7A7200RGTR  [QFN50P300X300X100-17N]
J4  2p-2.54  DIP-BLACK-MALE-HEADER-VERT(2P-2.54)  [H2-2.54]
J34  2p-2.54  DIP-BLACK-MALE-HEADER-VERT(2P-2.54)  [H2-2.54]
J35  2p-2.54  DIP-BLACK-MALE-HEADER-VERT(2P-2.54)  [H2-2.54]
J44  2p-2.54  DIP-BLACK-MALE-HEADER-VERT(2P-2.54)  [H2-2.54]
L13  10uH  INDUCTORPWR  [CDRH125]
PS13  LMR33630ADDA  [SOIC127P600X170-9N]
R209  100k  RES-0402  [RES-0402]
R216  10k  RES-0402  [RES-0402]
R231  100k  RES-0402  [RES-0402]
R232  100k  RES-0402  [RES-0402]

### Nets
2V5+ [power]: C253.1 C254.1 IC26.1(SNS) IC26.15(OUT_1) IC26.16(OUT_2) J35.2 R216.P$1 ; also sheet 1,2,3,4
2V5-1 [power]: C251.1 IC25.5(OUT) J34.1 ; also sheet 1,2
2V5-2 [power]: C76.1 IC10.5(OUT) J4.1 ; also sheet 3,4
3V0-: C77.1 C83.2(-) C252.1 C279.2 C281.2 C282.2 C288.2 C294.2 C295.2 C296.2 C297.2 D10.A IC10.2(IN) IC25.2(IN) J44.2 PS13.1(PGND) PS13.9(EP) R209.P$1 R232.P$1
3V3 [power]: C73.1 IC26.12(EN) IC26.13(IN_1) IC26.14(IN_2) ; also sheet 2,4,5,8,9,13,14,15
5V [power]: C279.1 C288.1 PS13.2(VIN) PS13.3(EN) ; also sheet 1,3,8,9,10,12,13,15
GND: C73.2 C74.2 C76.2 C77.2 C83.1(+) C250.2 C251.2 C252.2 C253.2 C254.2 C282.1 C294.1 C295.1 C296.1 C297.1 D10.C IC10.1(GND) IC25.1(GND) IC26.7(GND) IC26.8(400MV) IC26.10(1.6V) IC26.17(EP) J4.2 J34.2 J35.1 J44.1 L13.2 R231.P$2 ; also sheet 1,2,3,4,5,6,7,8,9,10,12,13,14,15
N$61: C74.1 IC10.4(NR/FB)
N$102: C250.1 IC25.4(NR/FB)
N$125: C280.1 L13.1 PS13.8(SW)
N$126: C280.2 PS13.7(BOOT)
N$127: PS13.5(FB) R209.P$2 R231.P$1 R232.P$2
N$128: C281.1 PS13.6(VCC)
PG25: IC26.3(PG) R216.P$2
Unconnected: IC10.3(EN) IC25.3(EN) IC26.2(FB) IC26.4(50MV) IC26.5(100MV) IC26.6(200MV) IC26.9(800MV) IC26.11(SS) PS13.4(PG)

### Notes on the sheet
- 2V5+
- For 2V5+, take input from 3V3
  Only ~300mA needed
- Need + and - 2.5V for the amplifiers
- = 0.5 + grounded inputs
- 2V5- 1
- V- for input amp reg ~ -3.0V
- Rbot = Rtop/(Vout-1)
  =100k/(3.0-1) = 50k
- Need separate -2v5 supplies for inputs A and B because each needs more than 100mA
  and each of these negative regulators can only make 200mA
- 2V5- 2
- Power - Amps

## Sheet 12 of 16: Power - FPGA
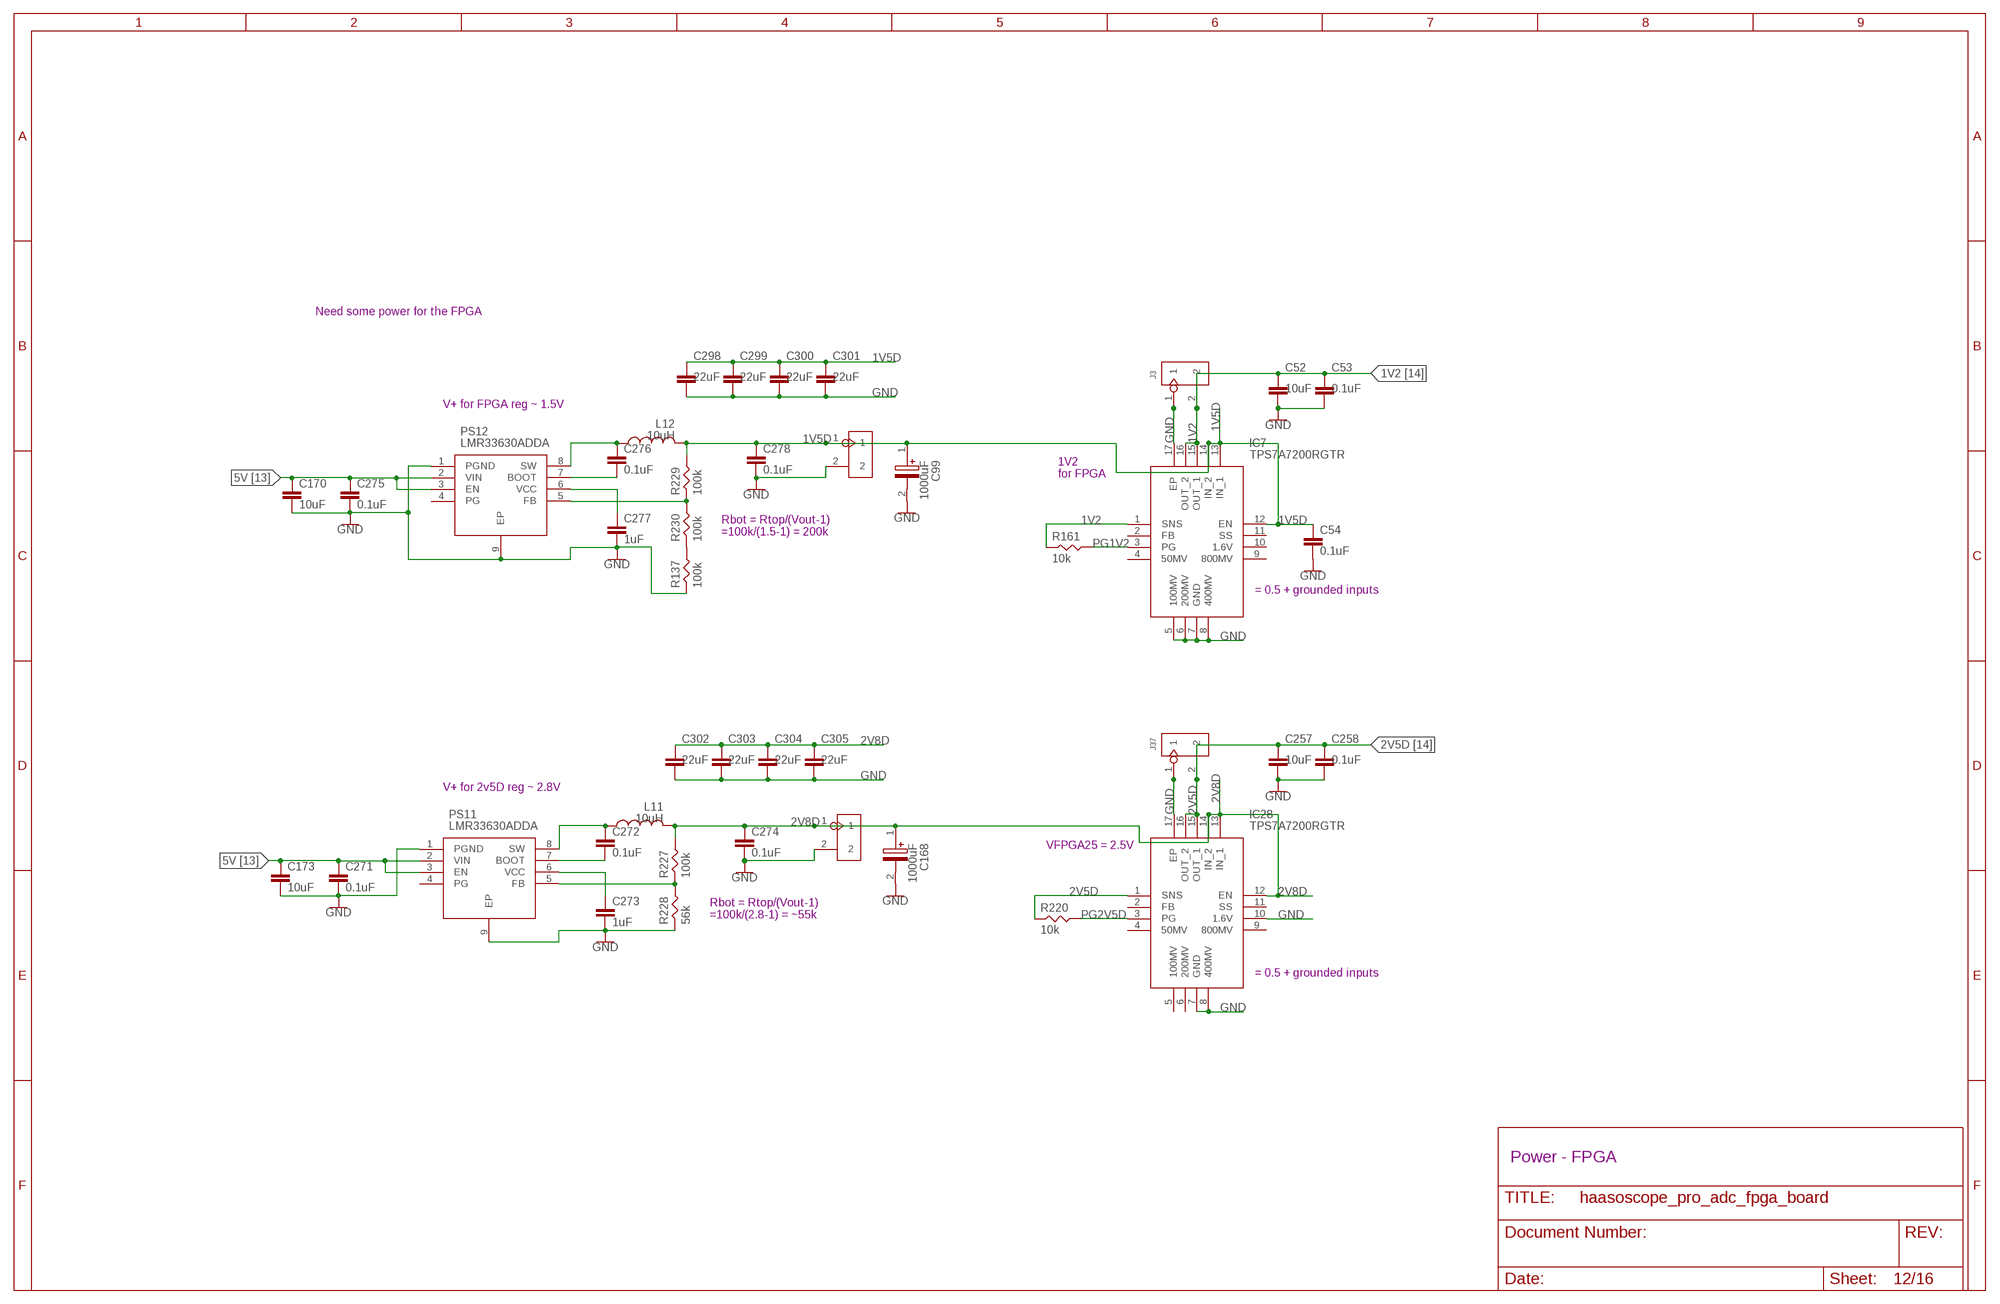
[diagram p11: schematic, sheet 12]

### Parts
C52  10uF  CAPACITOR_0805_N  [RESC0805_N]
C53  0.1uF  CAPACITOR_0402_N  [RESC0402_N]
C54  0.1uF  CAPACITOR_0402_N  [RESC0402_N]
C99  1000uF  EEE-FT1E102UP  [EEE0JA152UAP]
C168  1000uF  EEE-FT1E102UP  [EEE0JA152UAP]
C170  10uF  CAPACITOR_0805_N  [RESC0805_N]
C173  10uF  CAPACITOR_0805_N  [RESC0805_N]
C257  10uF  CAPACITOR_0805_N  [RESC0805_N]
C258  0.1uF  CAPACITOR_0402_N  [RESC0402_N]
C271  0.1uF  CAPACITOR_0402_N  [RESC0402_N]
C272  0.1uF  CAPACITOR_0402_N  [RESC0402_N]
C273  1uF  CAPACITOR_0402_N  [RESC0402_N]
C274  0.1uF  CAPACITOR_0402_N  [RESC0402_N]
C275  0.1uF  CAPACITOR_0402_N  [RESC0402_N]
C276  0.1uF  CAPACITOR_0402_N  [RESC0402_N]
C277  1uF  CAPACITOR_0402_N  [RESC0402_N]
C278  0.1uF  CAPACITOR_0402_N  [RESC0402_N]
C298  22uF  CAPACITOR_0805_N  [RESC0805_N]
C299  22uF  CAPACITOR_0805_N  [RESC0805_N]
C300  22uF  CAPACITOR_0805_N  [RESC0805_N]
C301  22uF  CAPACITOR_0805_N  [RESC0805_N]
C302  22uF  CAPACITOR_0805_N  [RESC0805_N]
C303  22uF  CAPACITOR_0805_N  [RESC0805_N]
C304  22uF  CAPACITOR_0805_N  [RESC0805_N]
C305  22uF  CAPACITOR_0805_N  [RESC0805_N]
IC7  TPS7A7200RGTR  [QFN50P300X300X100-17N]
IC28  TPS7A7200RGTR  [QFN50P300X300X100-17N]
J3  2p-2.54  DIP-BLACK-MALE-HEADER-VERT(2P-2.54)  [H2-2.54]
J37  2p-2.54  DIP-BLACK-MALE-HEADER-VERT(2P-2.54)  [H2-2.54]
J42  2p-2.54  DIP-BLACK-MALE-HEADER-VERT(2P-2.54)  [H2-2.54]
J43  2p-2.54  DIP-BLACK-MALE-HEADER-VERT(2P-2.54)  [H2-2.54]
L11  10uH  INDUCTORPWR  [CDRH125]
L12  10uH  INDUCTORPWR  [CDRH125]
PS11  LMR33630ADDA  [SOIC127P600X170-9N]
PS12  LMR33630ADDA  [SOIC127P600X170-9N]
R137  100k  RES-0402  [RES-0402]
R161  10k  RES-0402  [RES-0402]
R220  10k  RES-0402  [RES-0402]
R227  100k  RES-0402  [RES-0402]
R228  56k  RES-0402  [RES-0402]
R229  100k  RES-0402  [RES-0402]
R230  100k  RES-0402  [RES-0402]

### Nets
1V2 [power]: C52.1 C53.1 IC7.1(SNS) IC7.15(OUT_1) IC7.16(OUT_2) J3.2 R161.P$1 ; also sheet 14
1V5D: C54.1 C99.1(+) C278.1 C298.1 C299.1 C300.1 C301.1 IC7.12(EN) IC7.13(IN_1) IC7.14(IN_2) J43.1 L12.2 R229.P$2
2V5D [power]: C257.1 C258.1 IC28.1(SNS) IC28.15(OUT_1) IC28.16(OUT_2) J37.2 R220.P$1 ; also sheet 14
2V8D: C168.1(+) C274.1 C302.1 C303.1 C304.1 C305.1 IC28.12(EN) IC28.13(IN_1) IC28.14(IN_2) J42.1 L11.2 R227.P$2
5V [power]: C170.1 C173.1 C271.1 C275.1 PS11.2(VIN) PS11.3(EN) PS12.2(VIN) PS12.3(EN) ; also sheet 1,3,8,9,10,11,13,15
GND: C52.2 C53.2 C54.2 C99.2(-) C168.2(-) C170.2 C173.2 C257.2 C258.2 C271.2 C273.2 C274.2 C275.2 C277.2 C278.2 C298.2 C299.2 C300.2 C301.2 C302.2 C303.2 C304.2 C305.2 IC7.5(100MV) IC7.6(200MV) IC7.7(GND) IC7.8(400MV) IC7.17(EP) IC28.7(GND) IC28.8(400MV) IC28.10(1.6V) IC28.17(EP) J3.1 J37.1 J42.2 J43.2 PS11.1(PGND) PS11.9(EP) PS12.1(PGND) PS12.9(EP) R137.P$1 R228.P$1 ; also sheet 1,2,3,4,5,6,7,8,9,10,11,13,14,15
N$23: R137.P$2 R230.P$1
N$117: C272.1 L11.1 PS11.8(SW)
N$118: C272.2 PS11.7(BOOT)
N$119: PS11.5(FB) R227.P$1 R228.P$2
N$120: C273.1 PS11.6(VCC)
N$121: C276.1 L12.1 PS12.8(SW)
N$122: C276.2 PS12.7(BOOT)
N$123: PS12.5(FB) R229.P$1 R230.P$2
N$124: C277.1 PS12.6(VCC)
PG1V2: IC7.3(PG) R161.P$2
PG2V5D: IC28.3(PG) R220.P$2
Unconnected: IC7.2(FB) IC7.4(50MV) IC7.9(800MV) IC7.10(1.6V) IC7.11(SS) IC28.2(FB) IC28.4(50MV) IC28.5(100MV) IC28.6(200MV) IC28.9(800MV) IC28.11(SS) PS11.4(PG) PS12.4(PG)

### Notes on the sheet
- Need some power for the FPGA
- V+ for FPGA reg ~ 1.5V
- 1V2
  for FPGA
- Rbot = Rtop/(Vout-1)
  =100k/(1.5-1) = 200k
- = 0.5 + grounded inputs
- V+ for 2v5D reg ~ 2.8V
- VFPGA25 = 2.5V
- Rbot = Rtop/(Vout-1)
  =100k/(2.8-1) = ~55k
- = 0.5 + grounded inputs
- Power - FPGA

## Sheet 13 of 16: Power - ADC
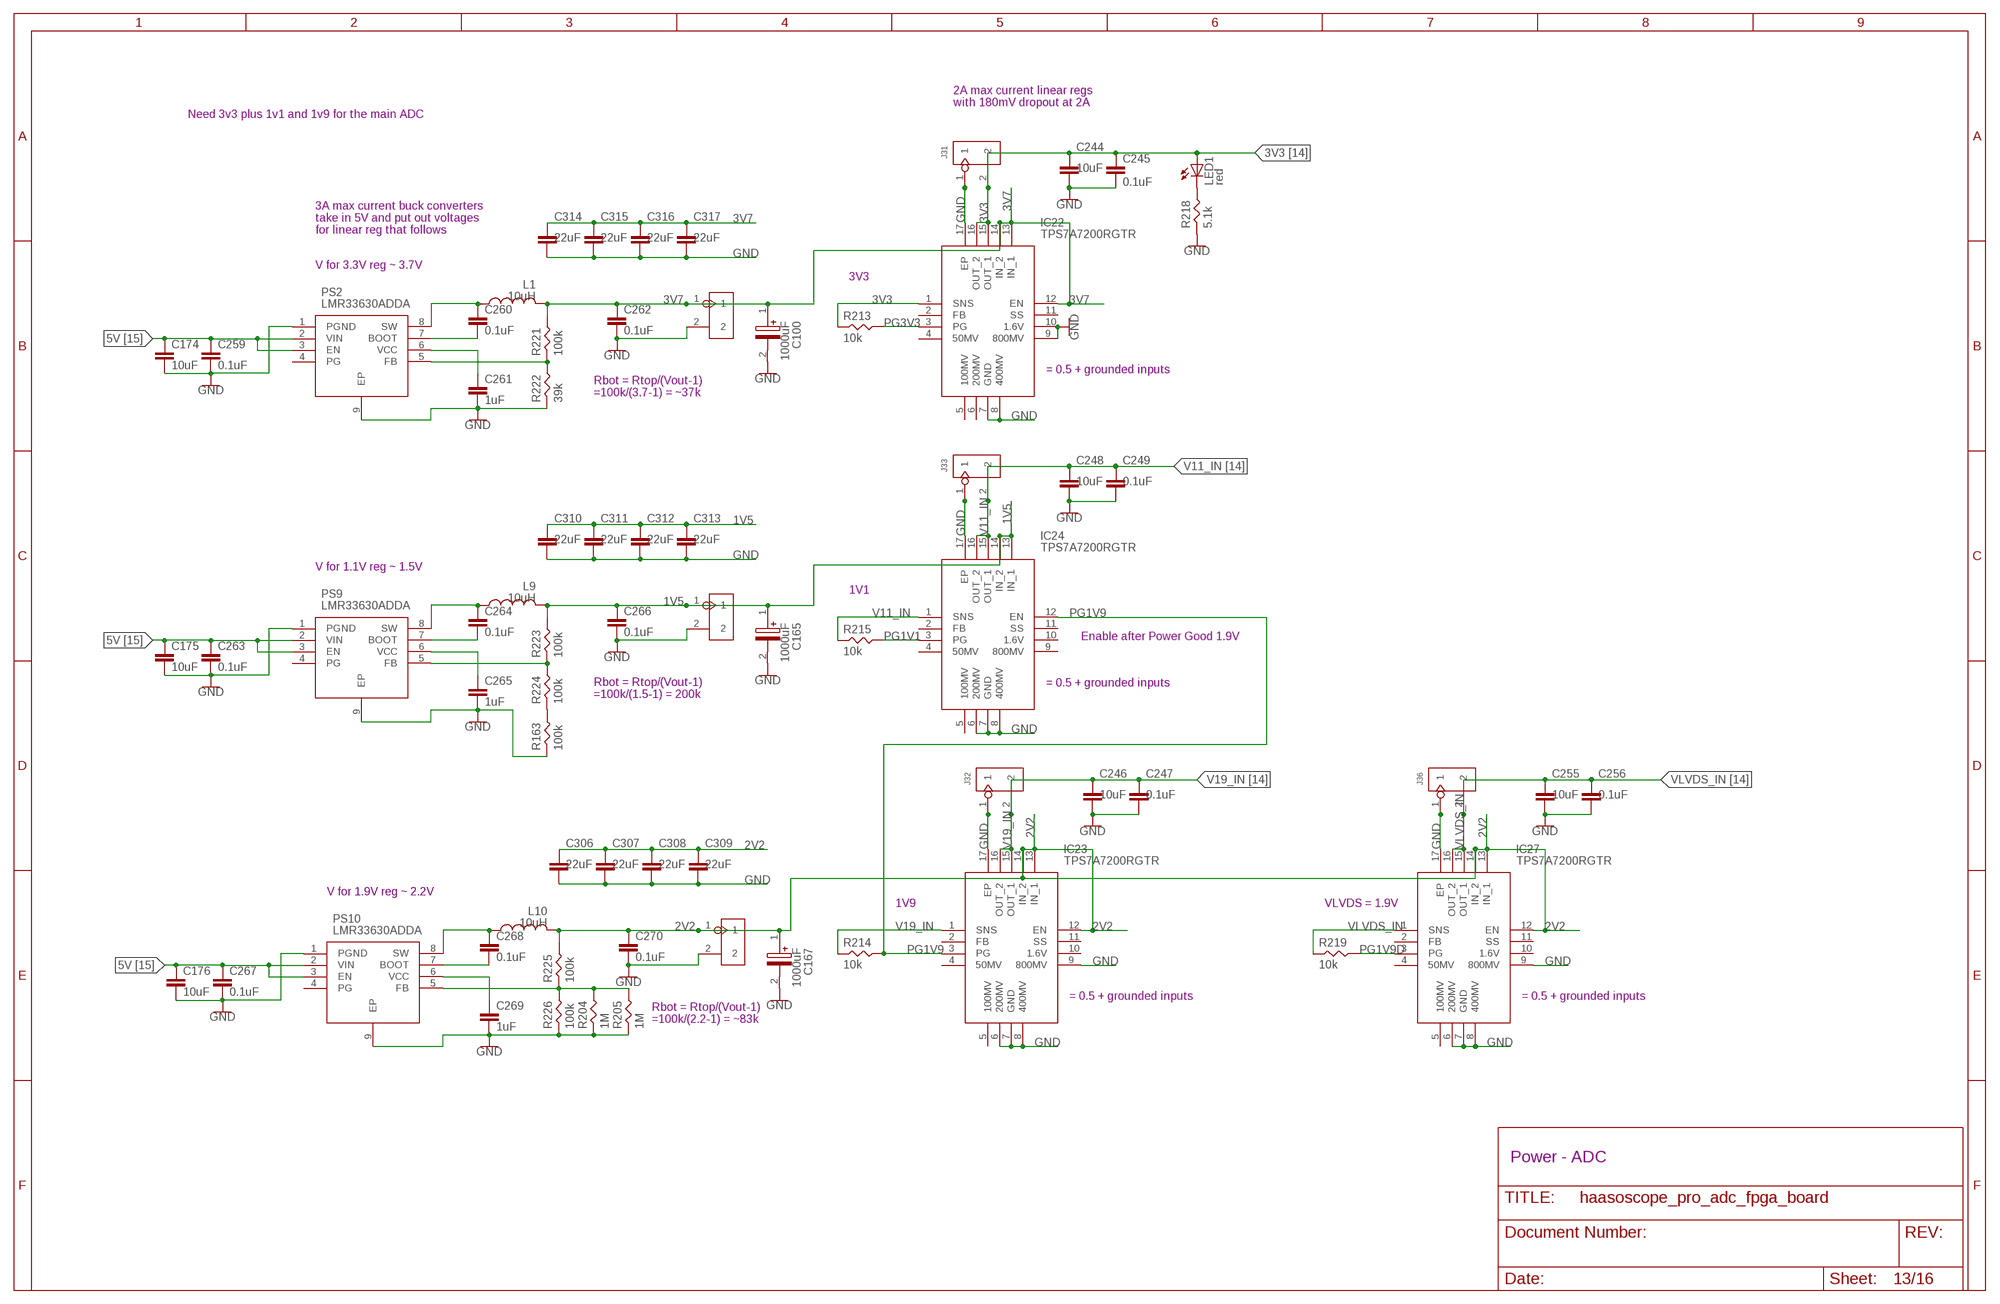
[diagram p12: schematic, sheet 13]

### Parts
C100  1000uF  EEE-FT1E102UP  [EEE0JA152UAP]
C165  1000uF  EEE-FT1E102UP  [EEE0JA152UAP]
C167  1000uF  EEE-FT1E102UP  [EEE0JA152UAP]
C174  10uF  CAPACITOR_0805_N  [RESC0805_N]
C175  10uF  CAPACITOR_0805_N  [RESC0805_N]
C176  10uF  CAPACITOR_0805_N  [RESC0805_N]
C244  10uF  CAPACITOR_0805_N  [RESC0805_N]
C245  0.1uF  CAPACITOR_0402_N  [RESC0402_N]
C246  10uF  CAPACITOR_0805_N  [RESC0805_N]
C247  0.1uF  CAPACITOR_0402_N  [RESC0402_N]
C248  10uF  CAPACITOR_0805_N  [RESC0805_N]
C249  0.1uF  CAPACITOR_0402_N  [RESC0402_N]
C255  10uF  CAPACITOR_0805_N  [RESC0805_N]
C256  0.1uF  CAPACITOR_0402_N  [RESC0402_N]
C259  0.1uF  CAPACITOR_0402_N  [RESC0402_N]
C260  0.1uF  CAPACITOR_0402_N  [RESC0402_N]
C261  1uF  CAPACITOR_0402_N  [RESC0402_N]
C262  0.1uF  CAPACITOR_0402_N  [RESC0402_N]
C263  0.1uF  CAPACITOR_0402_N  [RESC0402_N]
C264  0.1uF  CAPACITOR_0402_N  [RESC0402_N]
C265  1uF  CAPACITOR_0402_N  [RESC0402_N]
C266  0.1uF  CAPACITOR_0402_N  [RESC0402_N]
C267  0.1uF  CAPACITOR_0402_N  [RESC0402_N]
C268  0.1uF  CAPACITOR_0402_N  [RESC0402_N]
C269  1uF  CAPACITOR_0402_N  [RESC0402_N]
C270  0.1uF  CAPACITOR_0402_N  [RESC0402_N]
C306  22uF  CAPACITOR_0805_N  [RESC0805_N]
C307  22uF  CAPACITOR_0805_N  [RESC0805_N]
C308  22uF  CAPACITOR_0805_N  [RESC0805_N]
C309  22uF  CAPACITOR_0805_N  [RESC0805_N]
C310  22uF  CAPACITOR_0805_N  [RESC0805_N]
C311  22uF  CAPACITOR_0805_N  [RESC0805_N]
C312  22uF  CAPACITOR_0805_N  [RESC0805_N]
C313  22uF  CAPACITOR_0805_N  [RESC0805_N]
C314  22uF  CAPACITOR_0805_N  [RESC0805_N]
C315  22uF  CAPACITOR_0805_N  [RESC0805_N]
C316  22uF  CAPACITOR_0805_N  [RESC0805_N]
C317  22uF  CAPACITOR_0805_N  [RESC0805_N]
IC22  TPS7A7200RGTR  [QFN50P300X300X100-17N]
IC23  TPS7A7200RGTR  [QFN50P300X300X100-17N]
IC24  TPS7A7200RGTR  [QFN50P300X300X100-17N]
IC27  TPS7A7200RGTR  [QFN50P300X300X100-17N]
J31  2p-2.54  DIP-BLACK-MALE-HEADER-VERT(2P-2.54)  [H2-2.54]
J32  2p-2.54  DIP-BLACK-MALE-HEADER-VERT(2P-2.54)  [H2-2.54]
J33  2p-2.54  DIP-BLACK-MALE-HEADER-VERT(2P-2.54)  [H2-2.54]
J36  2p-2.54  DIP-BLACK-MALE-HEADER-VERT(2P-2.54)  [H2-2.54]
J39  2p-2.54  DIP-BLACK-MALE-HEADER-VERT(2P-2.54)  [H2-2.54]
J40  2p-2.54  DIP-BLACK-MALE-HEADER-VERT(2P-2.54)  [H2-2.54]
J41  2p-2.54  DIP-BLACK-MALE-HEADER-VERT(2P-2.54)  [H2-2.54]
L1  10uH  INDUCTORPWR  [CDRH125]
L9  10uH  INDUCTORPWR  [CDRH125]
L10  10uH  INDUCTORPWR  [CDRH125]
LED1  red  LEDCHIP-LED0603  [CHIP-LED0603]
PS2  LMR33630ADDA  [SOIC127P600X170-9N]
PS9  LMR33630ADDA  [SOIC127P600X170-9N]
PS10  LMR33630ADDA  [SOIC127P600X170-9N]
R163  100k  RES-0402  [RES-0402]
R204  1M  RES-0402  [RES-0402]
R205  1M  RES-0402  [RES-0402]
R213  10k  RES-0402  [RES-0402]
R214  10k  RES-0402  [RES-0402]
R215  10k  RES-0402  [RES-0402]
R218  5.1k  RES-0402  [RES-0402]
R219  10k  RES-0402  [RES-0402]
R221  100k  RES-0402  [RES-0402]
R222  39k  RES-0402  [RES-0402]
R223  100k  RES-0402  [RES-0402]
R224  100k  RES-0402  [RES-0402]
R225  100k  RES-0402  [RES-0402]
R226  100k  RES-0402  [RES-0402]

### Nets
1V5: C165.1(+) C266.1 C310.1 C311.1 C312.1 C313.1 IC24.13(IN_1) IC24.14(IN_2) J40.1 L9.2 R223.P$2
2V2: C167.1(+) C270.1 C306.1 C307.1 C308.1 C309.1 IC23.12(EN) IC23.13(IN_1) IC23.14(IN_2) IC27.12(EN) IC27.13(IN_1) IC27.14(IN_2) J41.1 L10.2 R225.P$2
3V3 [power]: C244.1 C245.1 IC22.1(SNS) IC22.15(OUT_1) IC22.16(OUT_2) J31.2 LED1.A R213.P$1 ; also sheet 2,4,5,8,9,11,14,15
3V7: C100.1(+) C262.1 C314.1 C315.1 C316.1 C317.1 IC22.12(EN) IC22.13(IN_1) IC22.14(IN_2) J39.1 L1.2 R221.P$2
5V [power]: C174.1 C175.1 C176.1 C259.1 C263.1 C267.1 PS2.2(VIN) PS2.3(EN) PS9.2(VIN) PS9.3(EN) PS10.2(VIN) PS10.3(EN) ; also sheet 1,3,8,9,10,11,12,15
GND: C100.2(-) C165.2(-) C167.2(-) C174.2 C175.2 C176.2 C244.2 C245.2 C246.2 C247.2 C248.2 C249.2 C255.2 C256.2 C259.2 C261.2 C262.2 C263.2 C265.2 C266.2 C267.2 C269.2 C270.2 C306.2 C307.2 C308.2 C309.2 C310.2 C311.2 C312.2 C313.2 C314.2 C315.2 C316.2 C317.2 IC22.7(GND) IC22.8(400MV) IC22.9(800MV) IC22.10(1.6V) IC22.17(EP) IC23.6(200MV) IC23.7(GND) IC23.8(400MV) IC23.9(800MV) IC23.17(EP) IC24.6(200MV) IC24.7(GND) IC24.8(400MV) IC24.17(EP) IC27.6(200MV) IC27.7(GND) IC27.8(400MV) IC27.9(800MV) IC27.17(EP) J31.1 J32.1 J33.1 J36.1 J39.2 J40.2 J41.2 PS2.1(PGND) PS2.9(EP) PS9.1(PGND) PS9.9(EP) PS10.1(PGND) PS10.9(EP) R163.P$1 R204.P$1 R205.P$1 R218.P$1 R222.P$1 R226.P$1 ; also sheet 1,2,3,4,5,6,7,8,9,10,11,12,14,15
N$38: R163.P$2 R224.P$1
N$105: C260.1 L1.1 PS2.8(SW)
N$106: C260.2 PS2.7(BOOT)
N$107: PS2.5(FB) R221.P$1 R222.P$2
N$108: C261.1 PS2.6(VCC)
N$109: C264.1 L9.1 PS9.8(SW)
N$110: C264.2 PS9.7(BOOT)
N$111: PS9.5(FB) R223.P$1 R224.P$2
N$112: C265.1 PS9.6(VCC)
N$113: C268.1 L10.1 PS10.8(SW)
N$114: C268.2 PS10.7(BOOT)
N$115: PS10.5(FB) R204.P$2 R205.P$2 R225.P$1 R226.P$2
N$116: C269.1 PS10.6(VCC)
N$138: LED1.C R218.P$2
PG1V1: IC24.3(PG) R215.P$2
PG1V9: IC23.3(PG) IC24.12(EN) R214.P$2
PG1V9D: IC27.3(PG) R219.P$2
PG3V3: IC22.3(PG) R213.P$2
V11_IN [power]: C248.1 C249.1 IC24.1(SNS) IC24.15(OUT_1) IC24.16(OUT_2) J33.2 R215.P$1 ; also sheet 14
V19_IN [power]: C246.1 C247.1 IC23.1(SNS) IC23.15(OUT_1) IC23.16(OUT_2) J32.2 R214.P$1 ; also sheet 14
VLVDS_IN [power]: C255.1 C256.1 IC27.1(SNS) IC27.15(OUT_1) IC27.16(OUT_2) J36.2 R219.P$1 ; also sheet 14
Unconnected: IC22.2(FB) IC22.4(50MV) IC22.5(100MV) IC22.6(200MV) IC22.11(SS) IC23.2(FB) IC23.4(50MV) IC23.5(100MV) IC23.10(1.6V) IC23.11(SS) IC24.2(FB) IC24.4(50MV) IC24.5(100MV) IC24.9(800MV) IC24.10(1.6V) IC24.11(SS) IC27.2(FB) IC27.4(50MV) IC27.5(100MV) IC27.10(1.6V) IC27.11(SS) PS2.4(PG) PS9.4(PG) PS10.4(PG)

### Notes on the sheet
- 2A max current linear regs
  with 180mV dropout at 2A
- Need 3v3 plus 1v1 and 1v9 for the main ADC
- 3A max current buck converters
  take in 5V and put out voltages
  for linear reg that follows
- V for 3.3V reg ~ 3.7V
- 3V3
- = 0.5 + grounded inputs
- Rbot = Rtop/(Vout-1)
  =100k/(3.7-1) = ~37k
- V for 1.1V reg ~ 1.5V
- 1V1
- Enable after Power Good 1.9V
- = 0.5 + grounded inputs
- Rbot = Rtop/(Vout-1)
  =100k/(1.5-1) = 200k
- V for 1.9V reg ~ 2.2V
- 1V9 | VLVDS = 1.9V
- = 0.5 + grounded inputs | = 0.5 + grounded inputs
- Rbot = Rtop/(Vout-1)
  =100k/(2.2-1) = ~83k
- Power - ADC

## Sheet 14 of 16: Power filters
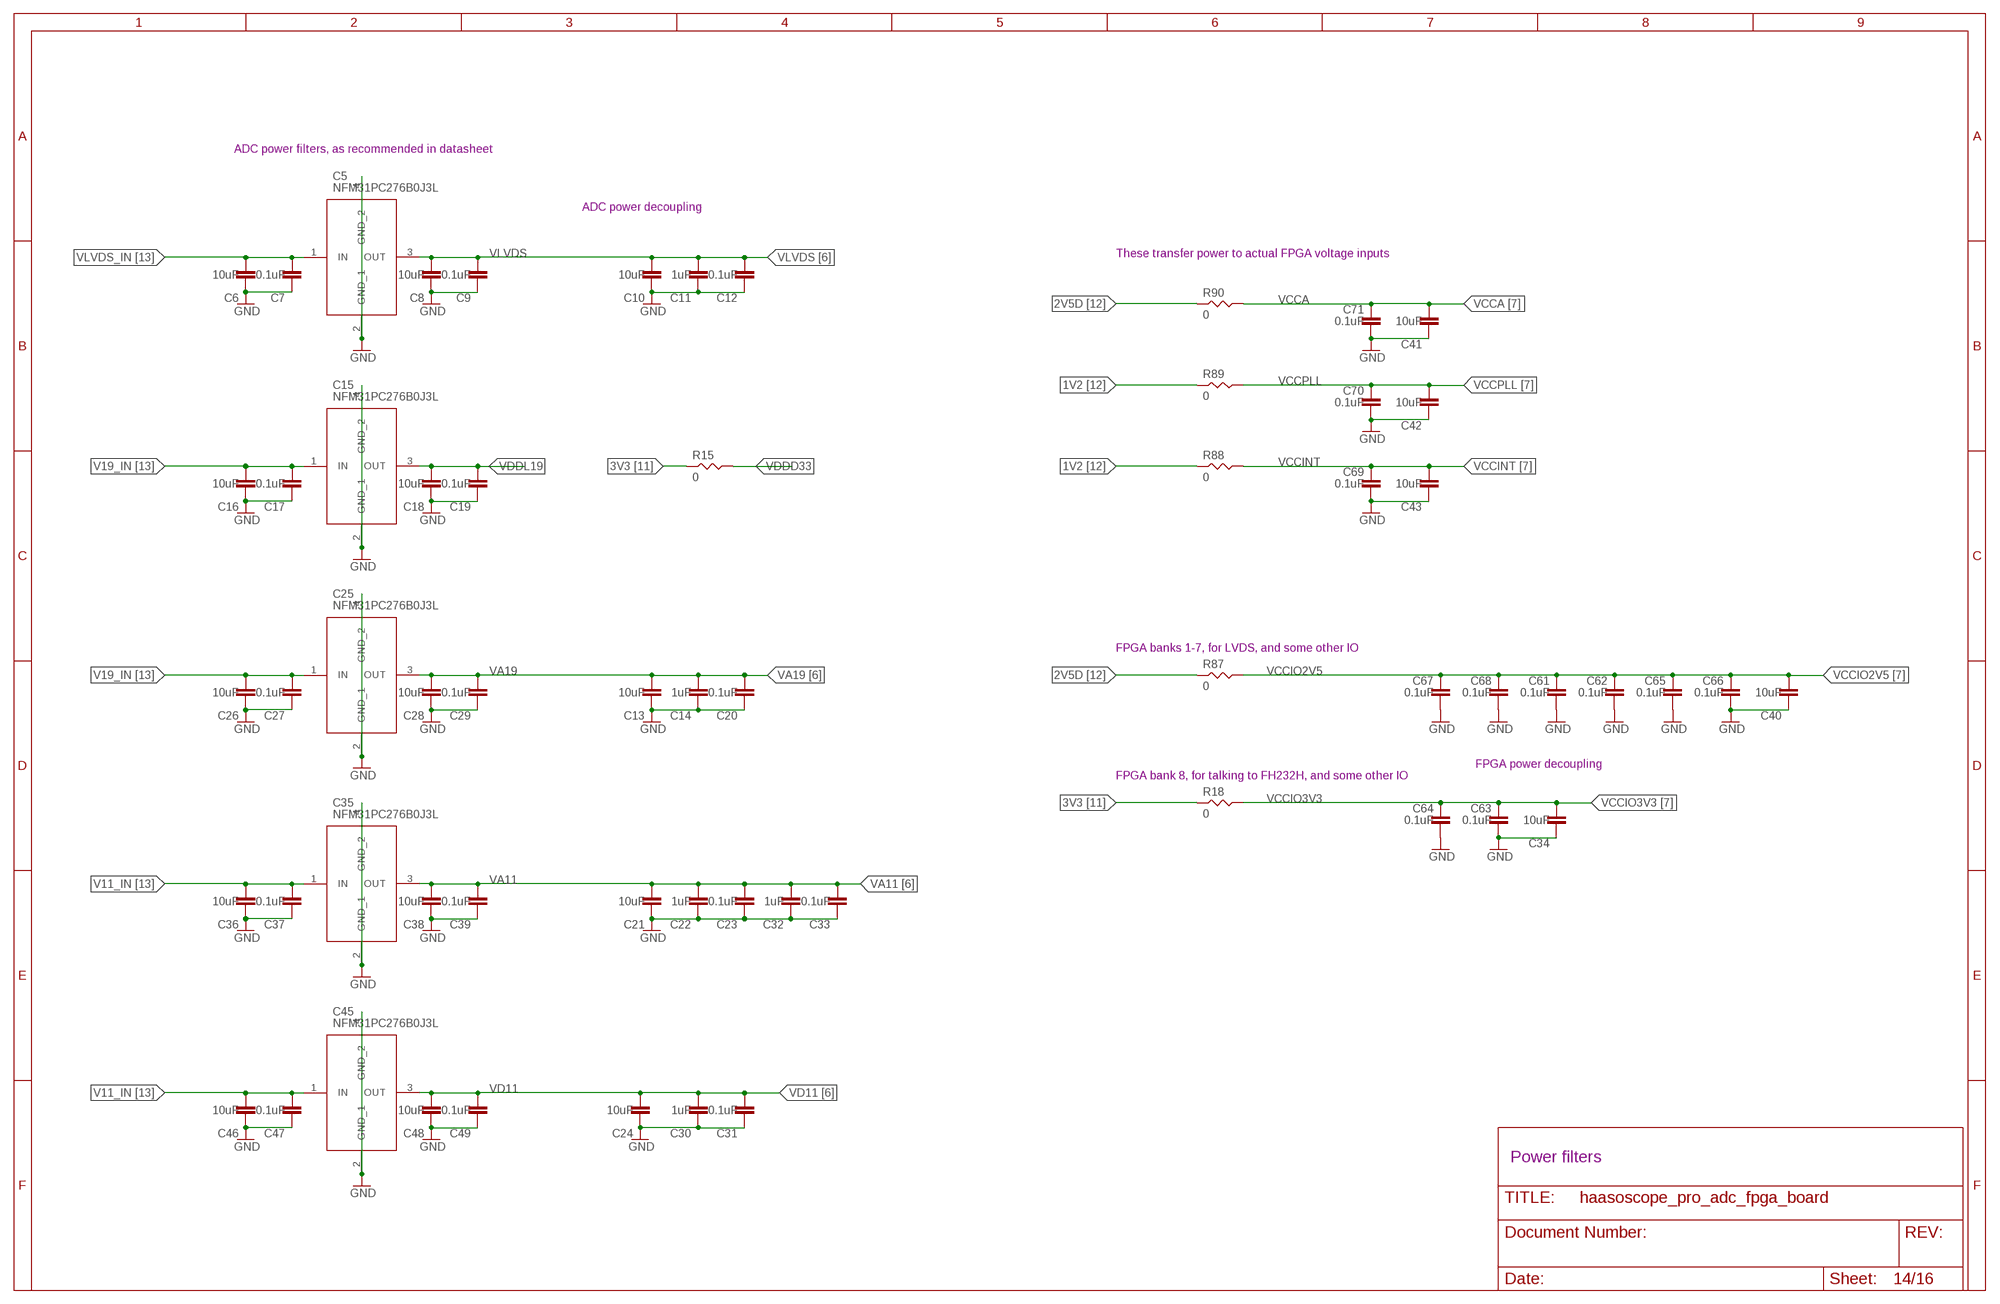
[diagram p13: schematic, sheet 14]

### Parts
C5  NFM31PC276B0J3L  [NFM31HK103R1H3L]
C6  10uF  CAPACITOR_0805_N  [RESC0805_N]
C7  0.1uF  CAPACITOR_0402_N  [RESC0402_N]
C8  10uF  CAPACITOR_0805_N  [RESC0805_N]
C9  0.1uF  CAPACITOR_0402_N  [RESC0402_N]
C10  10uF  CAPACITOR_0805_N  [RESC0805_N]
C11  1uF  CAPACITOR_0402_N  [RESC0402_N]
C12  0.1uF  CAPACITOR_0402_N  [RESC0402_N]
C13  10uF  CAPACITOR_0805_N  [RESC0805_N]
C14  1uF  CAPACITOR_0402_N  [RESC0402_N]
C15  NFM31PC276B0J3L  [NFM31HK103R1H3L]
C16  10uF  CAPACITOR_0805_N  [RESC0805_N]
C17  0.1uF  CAPACITOR_0402_N  [RESC0402_N]
C18  10uF  CAPACITOR_0805_N  [RESC0805_N]
C19  0.1uF  CAPACITOR_0402_N  [RESC0402_N]
C20  0.1uF  CAPACITOR_0402_N  [RESC0402_N]
C21  10uF  CAPACITOR_0805_N  [RESC0805_N]
C22  1uF  CAPACITOR_0402_N  [RESC0402_N]
C23  0.1uF  CAPACITOR_0402_N  [RESC0402_N]
C24  10uF  CAPACITOR_0805_N  [RESC0805_N]
C25  NFM31PC276B0J3L  [NFM31HK103R1H3L]
C26  10uF  CAPACITOR_0805_N  [RESC0805_N]
C27  0.1uF  CAPACITOR_0402_N  [RESC0402_N]
C28  10uF  CAPACITOR_0805_N  [RESC0805_N]
C29  0.1uF  CAPACITOR_0402_N  [RESC0402_N]
C30  1uF  CAPACITOR_0402_N  [RESC0402_N]
C31  0.1uF  CAPACITOR_0402_N  [RESC0402_N]
C32  1uF  CAPACITOR_0402_N  [RESC0402_N]
C33  0.1uF  CAPACITOR_0402_N  [RESC0402_N]
C34  10uF  CAPACITOR_0805_N  [RESC0805_N]
C35  NFM31PC276B0J3L  [NFM31HK103R1H3L]
C36  10uF  CAPACITOR_0805_N  [RESC0805_N]
C37  0.1uF  CAPACITOR_0402_N  [RESC0402_N]
C38  10uF  CAPACITOR_0805_N  [RESC0805_N]
C39  0.1uF  CAPACITOR_0402_N  [RESC0402_N]
C40  10uF  CAPACITOR_0805_N  [RESC0805_N]
C41  10uF  CAPACITOR_0805_N  [RESC0805_N]
C42  10uF  CAPACITOR_0805_N  [RESC0805_N]
C43  10uF  CAPACITOR_0805_N  [RESC0805_N]
C45  NFM31PC276B0J3L  [NFM31HK103R1H3L]
C46  10uF  CAPACITOR_0805_N  [RESC0805_N]
C47  0.1uF  CAPACITOR_0402_N  [RESC0402_N]
C48  10uF  CAPACITOR_0805_N  [RESC0805_N]
C49  0.1uF  CAPACITOR_0402_N  [RESC0402_N]
C61  0.1uF  CAPACITOR_0402_N  [RESC0402_N]
C62  0.1uF  CAPACITOR_0402_N  [RESC0402_N]
C63  0.1uF  CAPACITOR_0402_N  [RESC0402_N]
C64  0.1uF  CAPACITOR_0402_N  [RESC0402_N]
C65  0.1uF  CAPACITOR_0402_N  [RESC0402_N]
C66  0.1uF  CAPACITOR_0402_N  [RESC0402_N]
C67  0.1uF  CAPACITOR_0402_N  [RESC0402_N]
C68  0.1uF  CAPACITOR_0402_N  [RESC0402_N]
C69  0.1uF  CAPACITOR_0402_N  [RESC0402_N]
C70  0.1uF  CAPACITOR_0402_N  [RESC0402_N]
C71  0.1uF  CAPACITOR_0402_N  [RESC0402_N]
R15  0  RES-0402  [RES-0402]
R18  0  RES-0402  [RES-0402]
R87  0  RES-0402  [RES-0402]
R88  0  RES-0402  [RES-0402]
R89  0  RES-0402  [RES-0402]
R90  0  RES-0402  [RES-0402]

### Nets
1V2 [power]: R88.P$1 R89.P$1 ; also sheet 12
2V5D [power]: R87.P$1 R90.P$1 ; also sheet 12
3V3 [power]: R15.P$1 R18.P$1 ; also sheet 2,4,5,8,9,11,13,15
GND: C5.2(GND_1) C5.4(GND_2) C6.1 C7.1 C8.1 C9.1 C10.1 C11.1 C12.1 C13.1 C14.1 C15.2(GND_1) C15.4(GND_2) C16.1 C17.1 C18.1 C19.1 C20.1 C21.1 C22.1 C23.1 C24.1 C25.2(GND_1) C25.4(GND_2) C26.1 C27.1 C28.1 C29.1 C30.1 C31.1 C32.1 C33.1 C34.1 C35.2(GND_1) C35.4(GND_2) C36.1 C37.1 C38.1 C39.1 C40.1 C41.1 C42.1 C43.1 C45.2(GND_1) C45.4(GND_2) C46.1 C47.1 C48.1 C49.1 C61.1 C62.1 C63.1 C64.1 C65.1 C66.1 C67.1 C68.1 C69.1 C70.1 C71.1 ; also sheet 1,2,3,4,5,6,7,8,9,10,11,12,13,15
V11_IN [power]: C35.1(IN) C36.2 C37.2 C45.1(IN) C46.2 C47.2 ; also sheet 13
V19_IN [power]: C15.1(IN) C16.2 C17.2 C25.1(IN) C26.2 C27.2 ; also sheet 13
VA11 [power]: C21.2 C22.2 C23.2 C32.2 C33.2 C35.3(OUT) C38.2 C39.2 ; also sheet 6
VA19 [power]: C13.2 C14.2 C20.2 C25.3(OUT) C28.2 C29.2 ; also sheet 6
VCCA [power]: C41.2 C71.2 R90.P$2 ; also sheet 7
VCCINT [power]: C43.2 C69.2 R88.P$2 ; also sheet 7
VCCIO2V5 [power]: C40.2 C61.2 C62.2 C65.2 C66.2 C67.2 C68.2 R87.P$2 ; also sheet 7,10
VCCIO3V3 [power]: C34.2 C63.2 C64.2 R18.P$2 ; also sheet 7
VCCPLL [power]: C42.2 C70.2 R89.P$2 ; also sheet 7
VD11 [power]: C24.2 C30.2 C31.2 C45.3(OUT) C48.2 C49.2 ; also sheet 6
VDDD33 [power]: R15.P$2 ; also sheet 6
VDDL19 [power]: C15.3(OUT) C18.2 C19.2 ; also sheet 6
VLVDS [power]: C5.3(OUT) C8.2 C9.2 C10.2 C11.2 C12.2 ; also sheet 6
VLVDS_IN [power]: C5.1(IN) C6.2 C7.2 ; also sheet 13

### Notes on the sheet
- ADC power filters, as recommended in datasheet
- ADC power decoupling
- These transfer power to actual FPGA voltage inputs
- FPGA banks 1-7, for LVDS, and some other IO
- FPGA power decoupling
- FPGA bank 8, for talking to FH232H, and some other IO
- Power filters

## Sheet 15 of 16: Temp mon
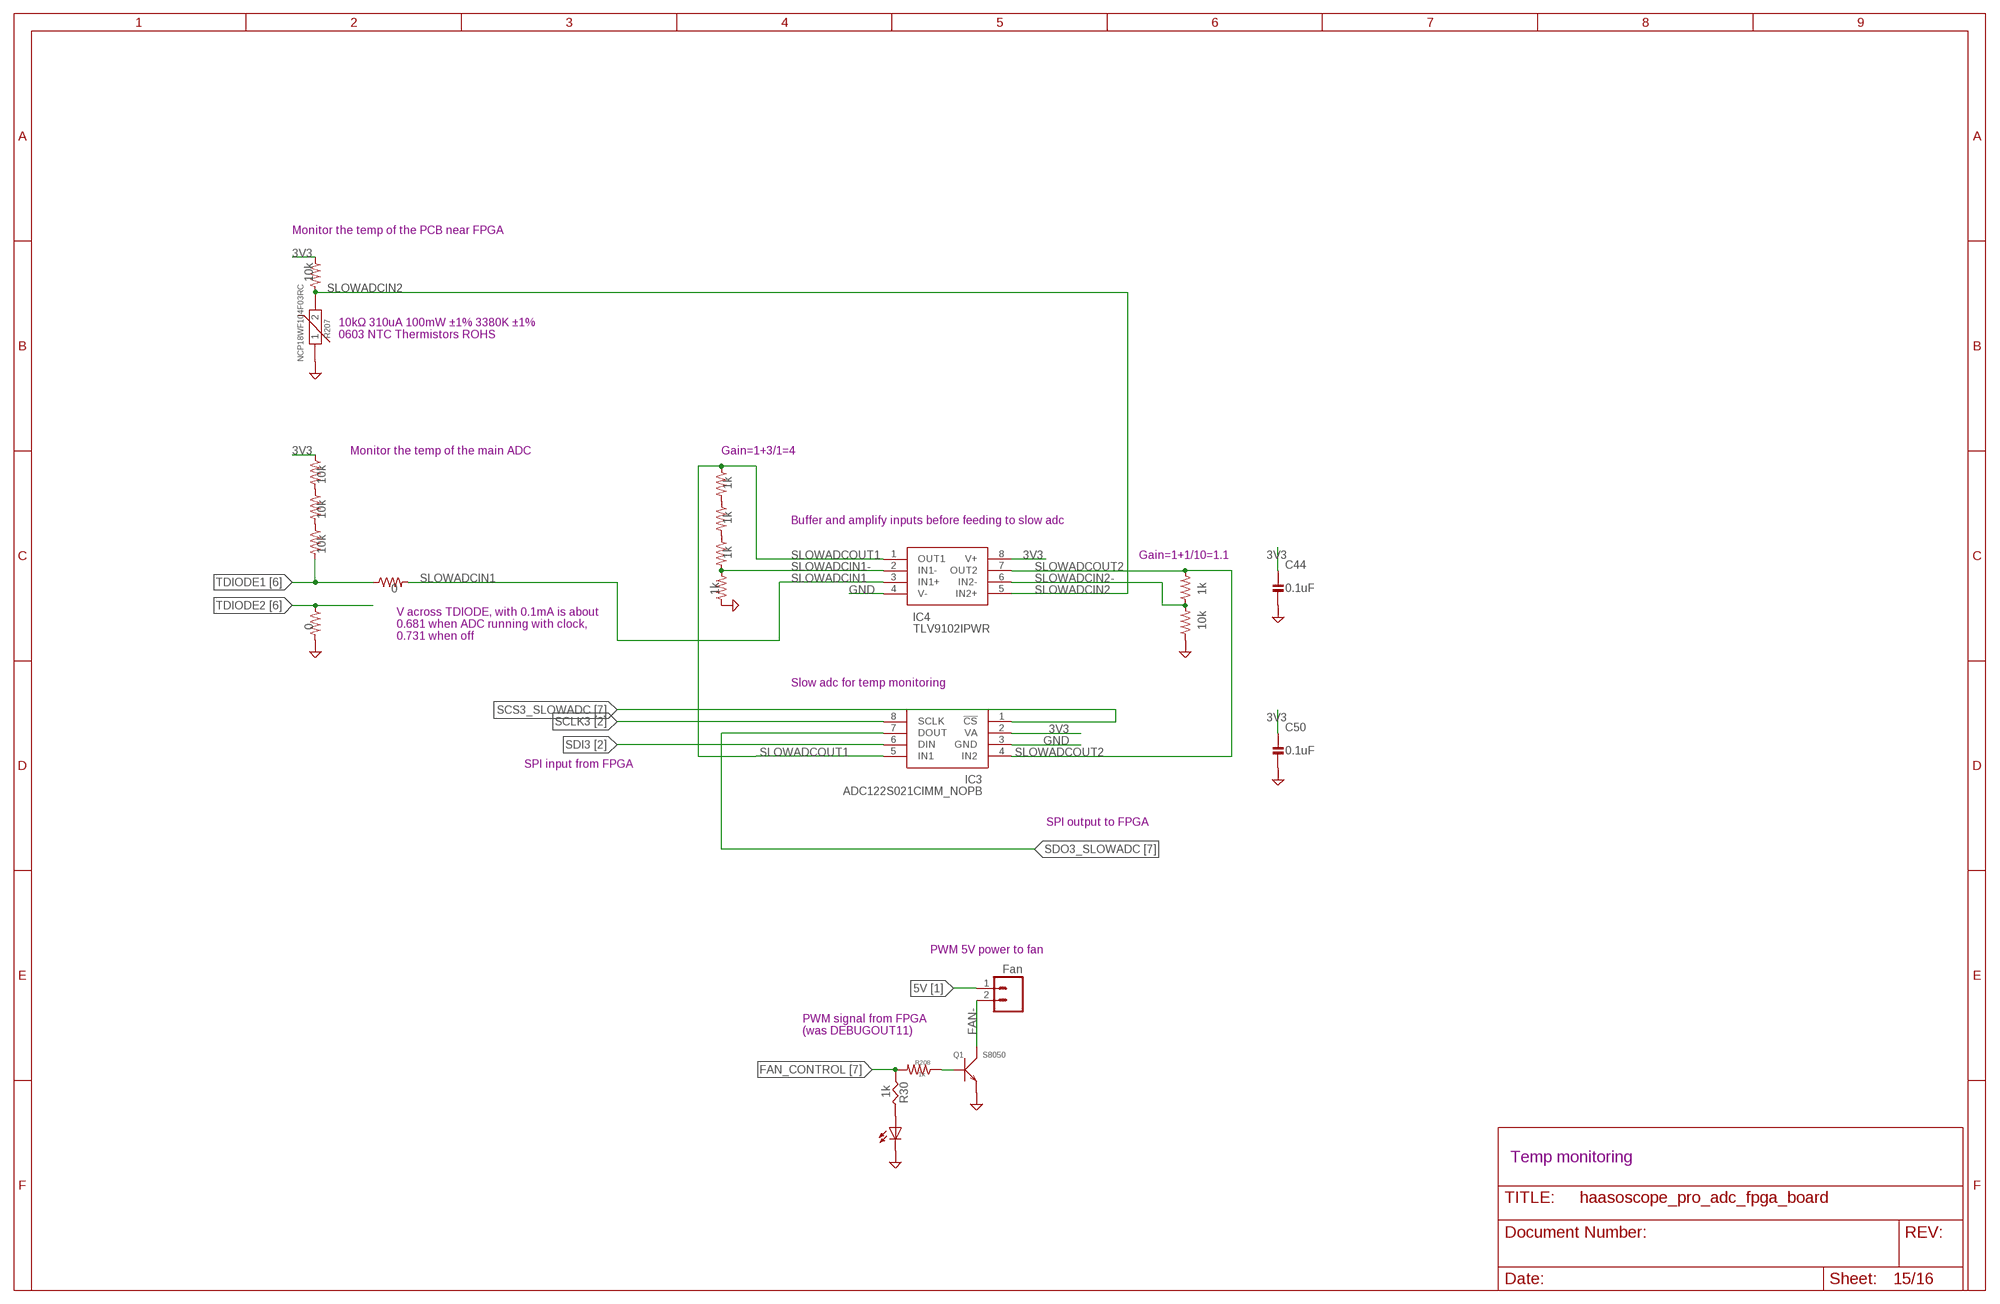
[diagram p14: schematic, sheet 15]

### Parts
C44  0.1uF  CAPACITOR0402_CAP  [0402_CAP]
C50  0.1uF  CAPACITOR0402_CAP  [0402_CAP]
IC3  ADC122S021CIMM_NOPB  [SOP65P490X110-8N]
IC4  TLV9102IPWR  [SOP65P640X120-8N]
JST_FAN  Fan  M02PTH  [1X02]
LED32  red  LEDCHIP-LED0603  [CHIP-LED0603]
Q1  S8050  SMD-TRANSISTORS-NPN-25V-500MW-S8050(SOT-23)  [SOT-23]
R30  1k  RES-0402  [RES-0402]
R122  1k  RESISTOR0402_RES  [0402_RES]
R124  1k  RESISTOR0402_RES  [0402_RES]
R125  10k  RESISTOR0402_RES  [0402_RES]
R126  1k  RESISTOR0402_RES  [0402_RES]
R127  10k  RESISTOR0402_RES  [0402_RES]
R128  0  RESISTOR0402_RES  [0402_RES]
R129  0  RESISTOR0402_RES  [0402_RES]
R130  10k  RESISTOR0402_RES  [0402_RES]
R186  10k  RESISTOR0402_RES  [0402_RES]
R198  10k  RESISTOR0402_RES  [0402_RES]
R202  1k  RESISTOR0402_RES  [0402_RES]
R203  1k  RESISTOR0402_RES  [0402_RES]
R207  NCP18WF104F03RC  THERMISTOR-RES-NTC-100K(0603)  [R0603]
R208  1k  RESISTOR_0402  [R0402]

### Nets
3V3 [power]: C44.1 C50.1 IC3.2(VA) IC4.8(V+) R127.1 R130.1 ; also sheet 2,4,5,8,9,11,13,14
5V [power]: JST_FAN.1 ; also sheet 1,3,8,9,10,11,12,13
FAN-: JST_FAN.2 Q1.3(C)
FAN_CONTROL: R30.P$1 R208.P$2 ; also sheet 7
GND: C44.2 C50.2 IC3.3(GND) IC4.4(V-) LED32.C Q1.2(E) R124.1 R125.1 R128.2 R207.1 ; also sheet 1,2,3,4,5,6,7,8,9,10,11,12,13,14
N$10: Q1.1(B) R208.P$1
N$32: LED32.A R30.P$2
N$49: R127.2 R186.1
N$54: R186.2 R198.1
N$57: R122.2 R202.1
N$58: R202.2 R203.1
SCLK3: IC3.8(SCLK) ; also sheet 2,4,5,6,7
SCS3_SLOWADC: IC3.1(!CS) ; also sheet 7
SDI3: IC3.6(DIN) ; also sheet 2,4,5,6,7
SDO3_SLOWADC: IC3.7(DOUT) ; also sheet 7
SLOWADCIN1: IC4.3(IN1+) R129.2
SLOWADCIN1-: IC4.2(IN1-) R124.2 R203.2
SLOWADCIN2: IC4.5(IN2+) R130.2 R207.2
SLOWADCIN2-: IC4.6(IN2-) R125.2 R126.1
SLOWADCOUT1: IC3.5(IN1) IC4.1(OUT1) R122.1
SLOWADCOUT2: IC3.4(IN2) IC4.7(OUT2) R126.2
TDIODE1: R129.1 R198.2 ; also sheet 6
TDIODE2: R128.1 ; also sheet 6

### Notes on the sheet
- Monitor the temp of the PCB near FPGA
- 10kΩ 310uA 100mW ±1% 3380K ±1%
  0603 NTC Thermistors ROHS
- Monitor the temp of the main ADC | Gain=1+3/1=4
- Buffer and amplify inputs before feeding to slow adc
- Gain=1+1/10=1.1
- V across TDIODE, with 0.1mA is about
  0.681 when ADC running with clock, 
  0.731 when off
- Slow adc for temp monitoring
- SPI input from FPGA
- SPI output to FPGA
- PWM 5V power to fan
- PWM signal from FPGA
  (was DEBUGOUT11)
- Temp monitoring

## Sheet 16 of 16: Testing
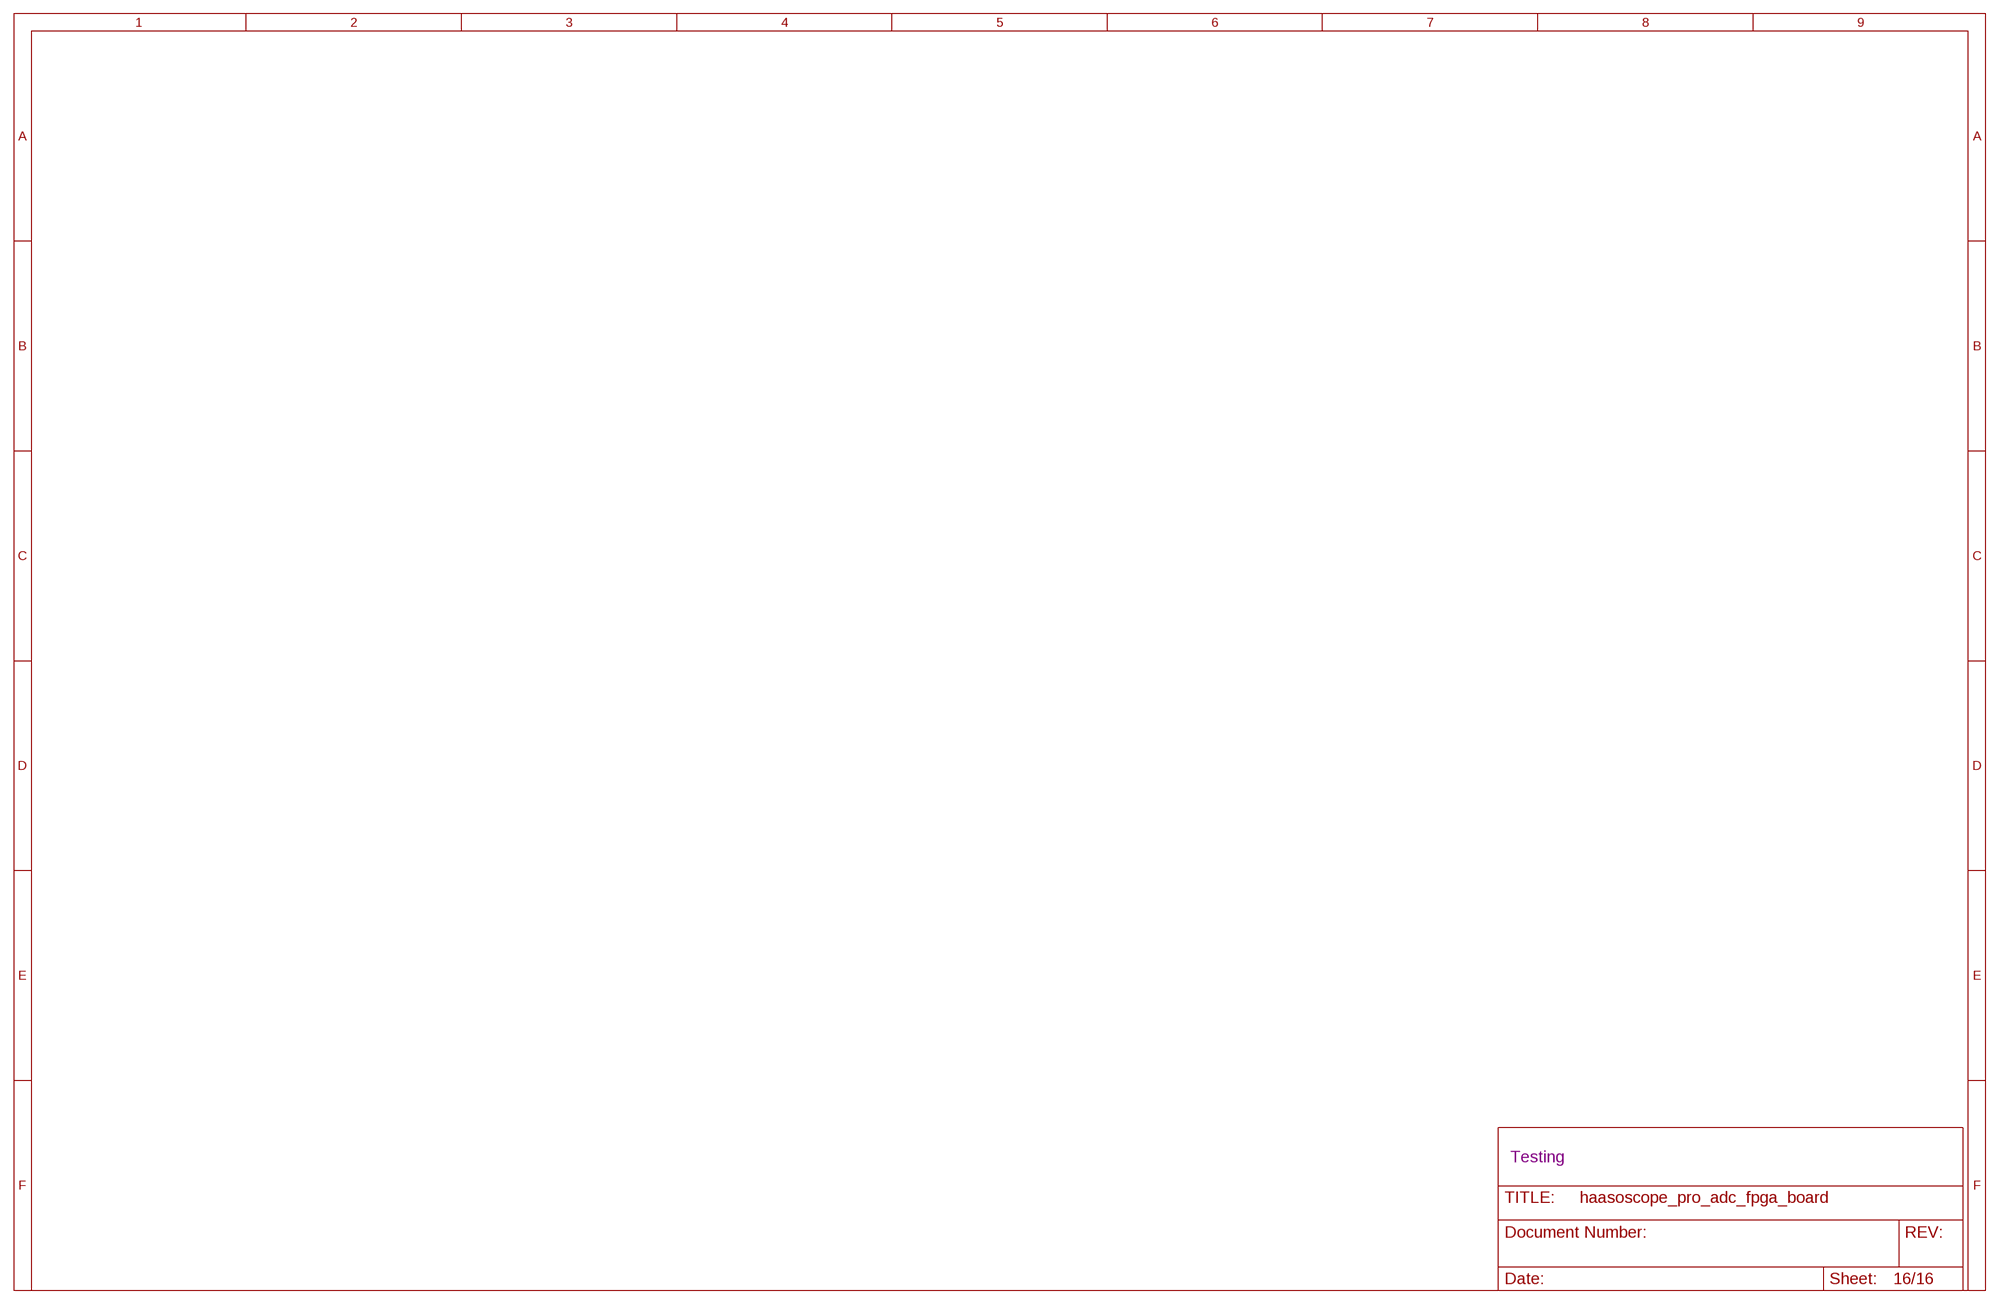
[diagram p15: schematic, sheet 16]

### Notes on the sheet
- Testing

## Power pins joined to a net without a drawn wire
GND: U2.PAD@1_1(GND) U2.PAD@1_2(GND) U2.PAD@1_3(GND) U2.PAD@2_1(GND) U2.PAD@2_2(GND) U2.PAD@2_3(GND) U2.PAD@3_1(GND) U2.PAD@3_2(GND) U2.PAD@3_3(GND)